# EAGLE design psp-panda (EAGLE 5.11)

## Sheet 1 of 6
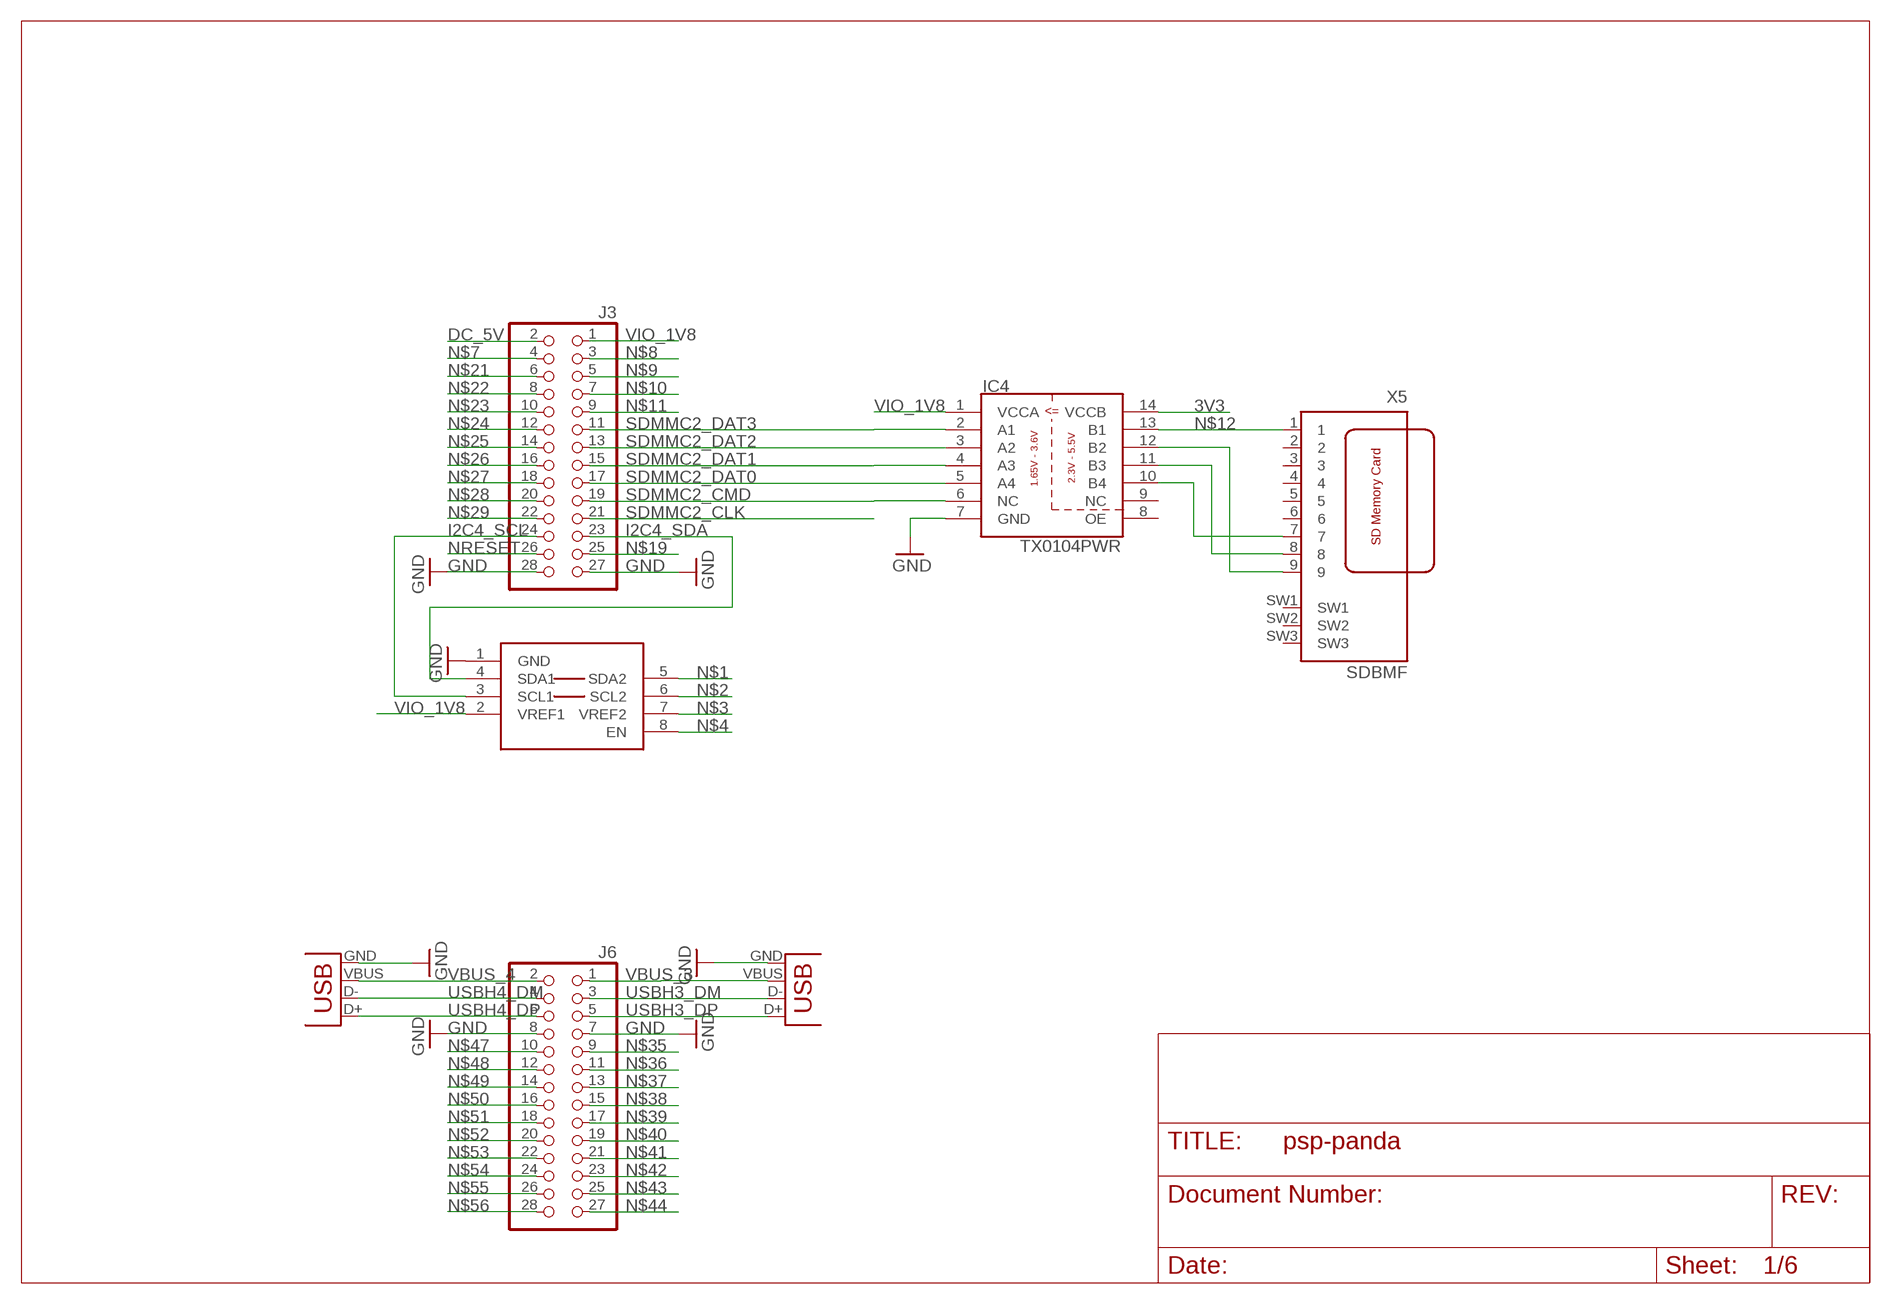
[diagram p0: schematic, sheet 1]

### Parts
IC4  TX0104PWR  [TSSOP14]
J3  PINHD-2X14  [2X14]
J6  PINHD-2X14  [2X14]
U$4  PCA9306  [PSOP-8]
X3  USB-A-S  [USB-A-S]
X4  USB-A-S  [USB-A-S]
X5  SDBMF  [SDBMF-009XXBXX2]

### Nets
3V3: IC4.14(VCCB) ; also sheet 2,4,5
DC_5V: J3.2
GND: IC4.7(GND) J3.27 J3.28 J6.7 J6.8 U$4.1(GND) X3.GND X4.GND ; also sheet 2,4,5,6
I2C4_SCL: J3.24 U$4.3(SCL1)
I2C4_SDA: J3.23 U$4.4(SDA1)
N$1: U$4.5(SDA2)
N$2: U$4.6(SCL2)
N$3: U$4.7(VREF2)
N$4: U$4.8(EN)
N$7: J3.4
N$8: J3.3
N$9: J3.5
N$10: J3.7
N$11: J3.9
N$12: IC4.13(B1) X5.1
N$13: IC4.12(B2) X5.9
N$14: IC4.11(B3) X5.8
N$15: IC4.10(B4) X5.7
N$19: J3.25
N$21: J3.6
N$22: J3.8
N$23: J3.10
N$24: J3.12
N$25: J3.14
N$26: J3.16
N$27: J3.18
N$28: J3.20
N$29: J3.22
N$35: J6.9
N$36: J6.11
N$37: J6.13
N$38: J6.15
N$39: J6.17
N$40: J6.19
N$41: J6.21
N$42: J6.23
N$43: J6.25
N$44: J6.27
N$47: J6.10
N$48: J6.12
N$49: J6.14
N$50: J6.16
N$51: J6.18
N$52: J6.20
N$53: J6.22
N$54: J6.24
N$55: J6.26
N$56: J6.28
NRESET: J3.26
SDMMC2_CLK: J3.21
SDMMC2_CMD: IC4.6(NC) J3.19
SDMMC2_DAT0: IC4.5(A4) J3.17
SDMMC2_DAT1: IC4.4(A3) J3.15
SDMMC2_DAT2: IC4.3(A2) J3.13
SDMMC2_DAT3: IC4.2(A1) J3.11
USBH3_DM: J6.3 X4.D-
USBH3_DP: J6.5 X4.D+
USBH4_DM: J6.4 X3.D-
USBH4_DP: J6.6 X3.D+
VBUS_3: J6.1 X4.VBUS
VBUS_4: J6.2 X3.VBUS
VIO_1V8: IC4.1(VCCA) J3.1 U$4.2(VREF1)
Unconnected: IC4.8(OE) IC4.9(NC) X5.2 X5.3 X5.4 X5.5 X5.6 X5.SW1 X5.SW2 X5.SW3

## Sheet 2 of 6
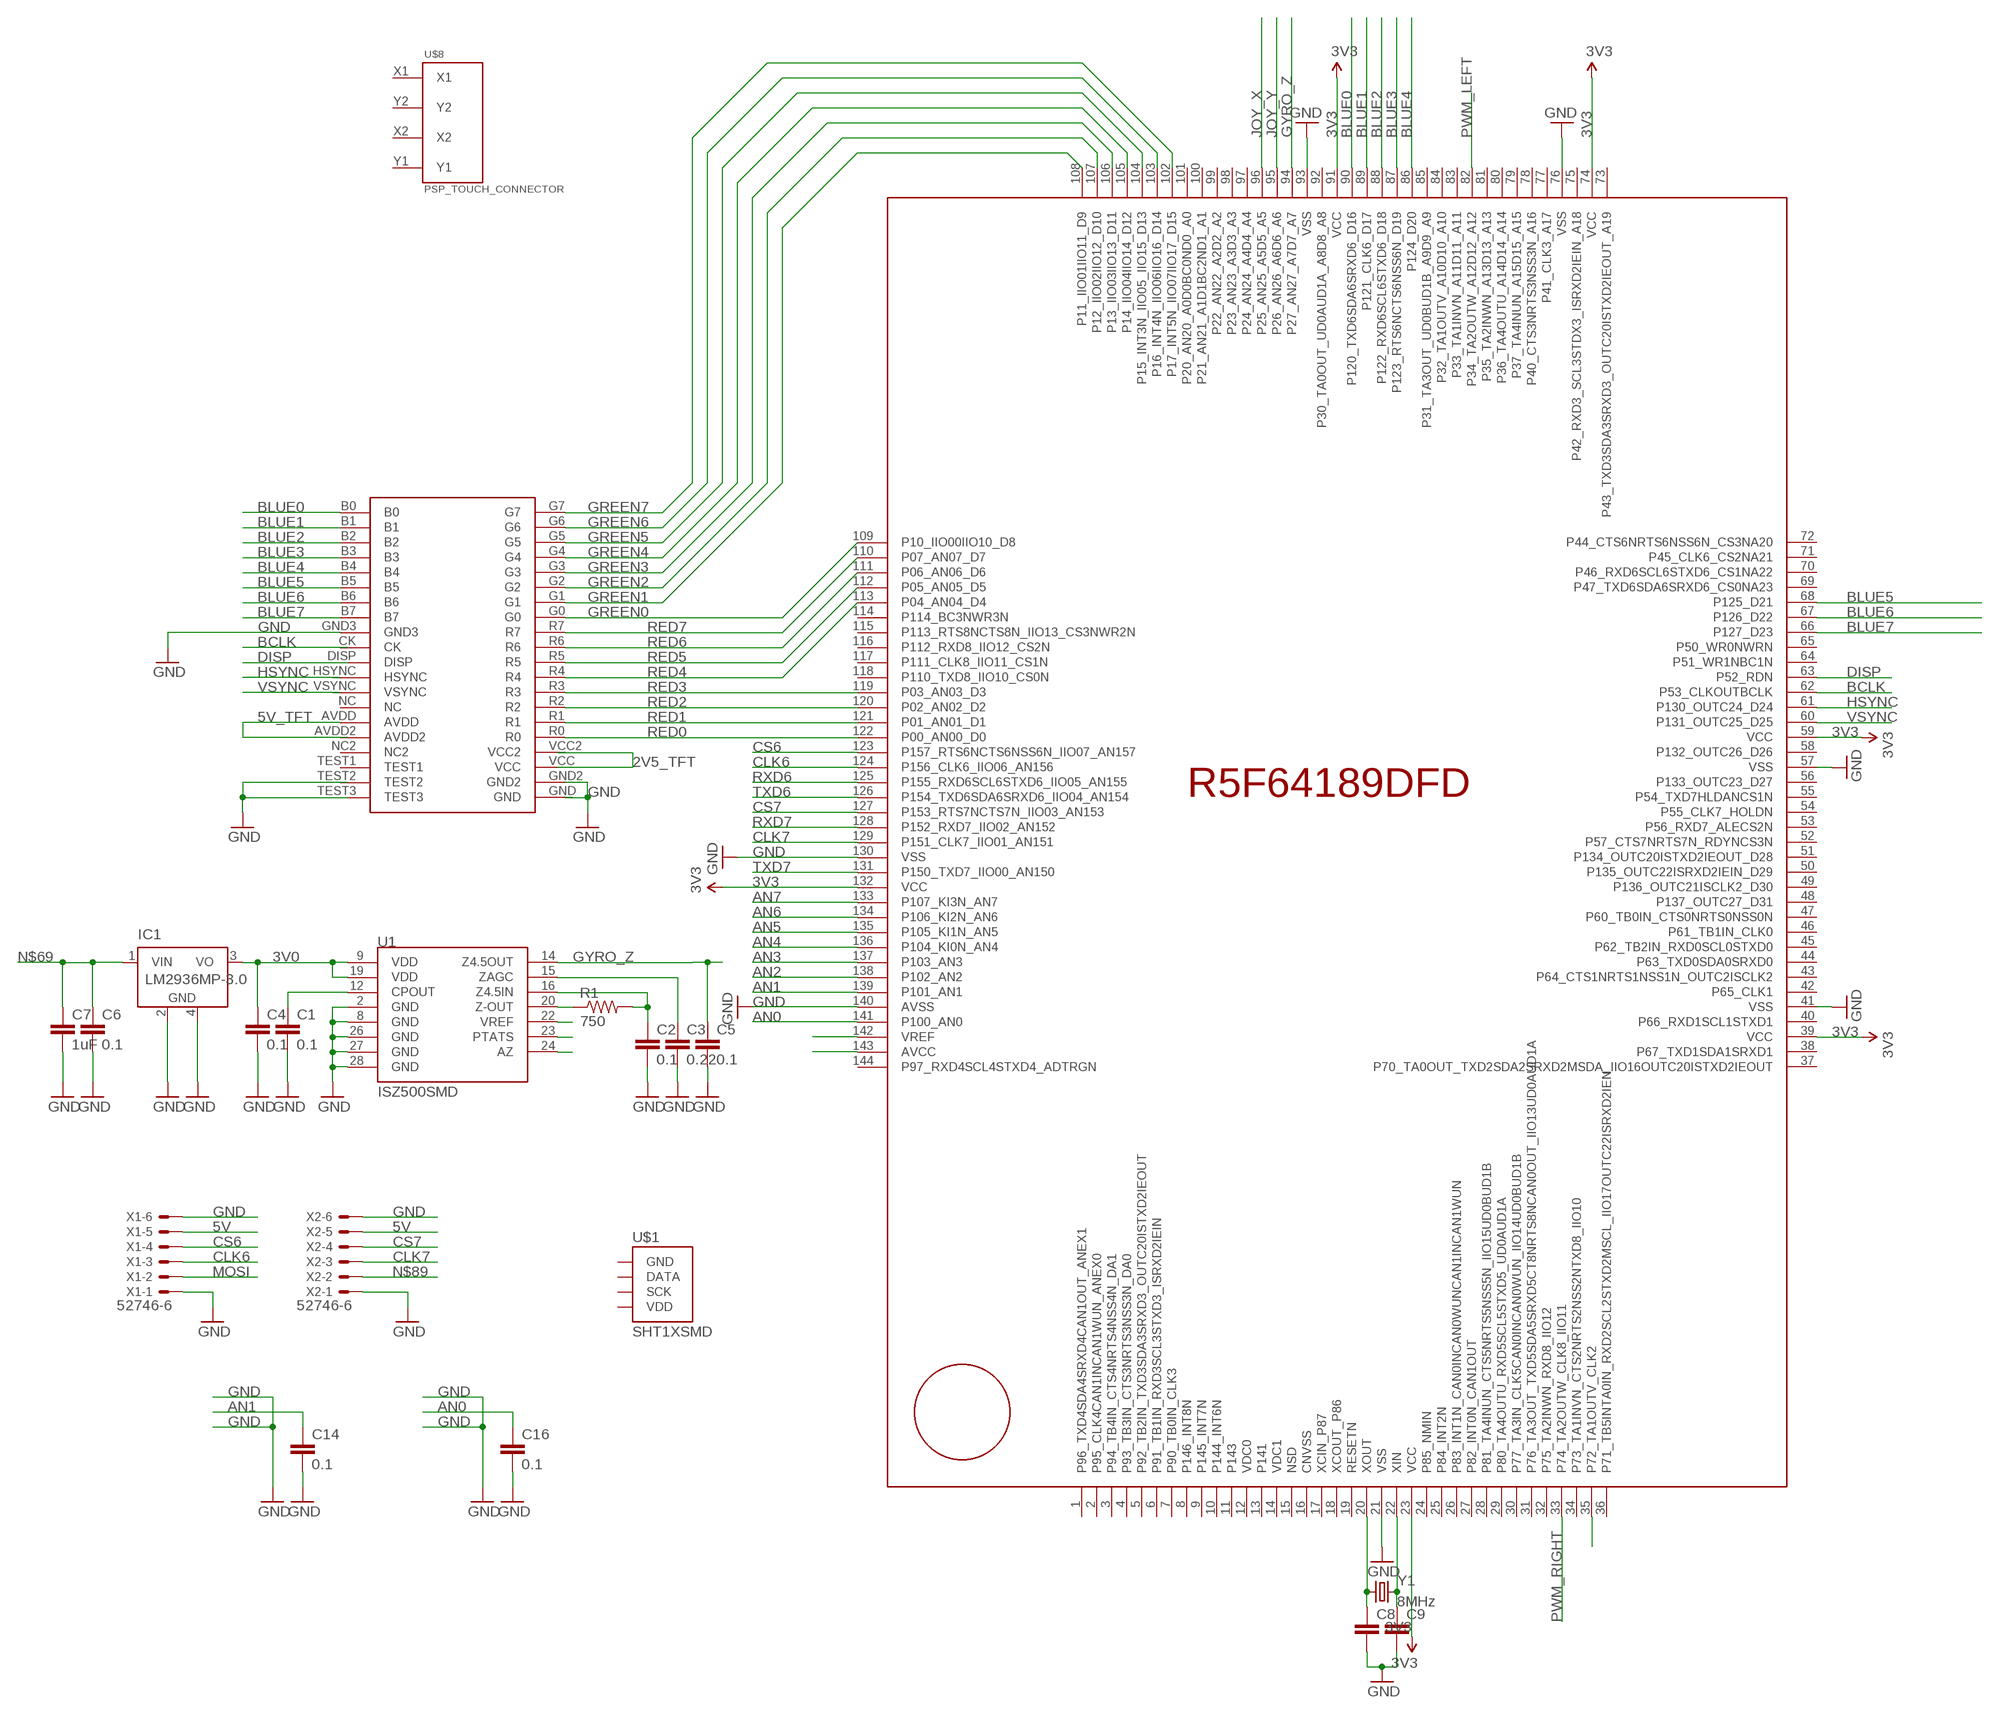
[diagram p1: schematic, sheet 2]

### Parts
C1  0.1  CAP0603-CAP  [0603-CAP]
C2  0.1  CAP0603-CAP  [0603-CAP]
C3  0.22  CAP0603-CAP  [0603-CAP]
C4  0.1  CAP0603-CAP  [0603-CAP]
C5  0.1  CAP0603-CAP  [0603-CAP]
C6  0.1  CAP0603-CAP  [0603-CAP]
C7  1uF  CAP0603-CAP  [0603-CAP]
C8  CAP0603-CAP  [0603-CAP]
C9  CAP0603-CAP  [0603-CAP]
C14  0.1  CAP0603-CAP  [0603-CAP]
C16  0.1  CAP0603-CAP  [0603-CAP]
IC1  LM2936MP-3.0  [SOT223]
R1  750  RESISTOR0603-RES  [0603-RES]
U1  ISZ500SMD  [QFN-28_6X8]
U$1  SHT1XSMD  [SHT1X]
U$7  R5F64189DFD  [TQFP144]
U$8  PSP_TOUCH_CONNECTOR  [PSP_TOUCH_CONNECTOR]
U$9  PSP_CONNECTOR  [PSP_CONNECTOR]
X1  52746-6  [52746-6]
X2  52746-6  [52746-6]
Y1  8MHz  CRYSTALHC49UV  [HC49U-V]

### Nets
2V5_TFT: U$9.VCC U$9.VCC2
3V0: C4.1 IC1.3(VO) U1.9(VDD) U1.19(VDD)
3V3: U$7.23(VCC) U$7.39(VCC) U$7.59(VCC) U$7.74(VCC) U$7.91(VCC) U$7.132(VCC) ; also sheet 1,4,5
5V: X1.5 X2.5
5V_TFT: U$9.AVDD U$9.AVDD2
AN0: C16.1 U$7.141(P100_AN0) ; also sheet 5
AN1: C14.1 U$7.139(P101_AN1) ; also sheet 4
AN2: U$7.138(P102_AN2)
AN3: U$7.137(P103_AN3)
AN4: U$7.136(P104_KI0N_AN4)
AN5: U$7.135(P105_KI1N_AN5)
AN6: U$7.134(P106_KI2N_AN6)
AN7: U$7.133(P107_KI3N_AN7)
BCLK: U$7.62(P53_CLKOUTBCLK) U$9.CK
BLUE0: U$7.90(P120_TXD6SDA6SRXD6_D16) U$9.B0
BLUE1: U$7.89(P121_CLK6_D17) U$9.B1
BLUE2: U$7.88(P122_RXD6SCL6STXD6_D18) U$9.B2
BLUE3: U$7.87(P123_RTS6NCTS6NSS6N_D19) U$9.B3
BLUE4: U$7.86(P124_D20) U$9.B4
BLUE5: U$7.68(P125_D21) U$9.B5
BLUE6: U$7.67(P126_D22) U$9.B6
BLUE7: U$7.66(P127_D23) U$9.B7
CLK6: U$7.124(P156_CLK6_IIO06_AN156) X1.3
CLK7: U$7.129(P151_CLK7_IIO01_AN151) X2.3
CPOUT: C1.1 U1.12(CPOUT)
CS6: U$7.123(P157_RTS6NCTS6NSS6N_IIO07_AN157) X1.4
CS7: U$7.127(P153_RTS7NCTS7N_IIO03_AN153) X2.4
DISP: U$7.63(P52_RDN) U$9.DISP
GND: C1.2 C2.2 C3.2 C4.2 C5.2 C6.2 C7.2 C8.2 C9.2 C14.2 C16.2 IC1.2(GND) IC1.4(GND) U1.2(GND) U1.8(GND) U1.26(GND) U1.27(GND) U1.28(GND) U$7.21(VSS) U$7.41(VSS) U$7.57(VSS) U$7.76(VSS) U$7.93(VSS) U$7.130(VSS) U$7.140(AVSS) U$9.GND U$9.GND2 U$9.GND3 X1.1 X1.6 X2.1 X2.6 ; also sheet 1,4,5,6
GREEN0: U$7.109(P10_IIO00IIO10_D8) U$9.G0
GREEN1: U$7.108(P11_IIO01IIO11_D9) U$9.G1
GREEN2: U$7.107(P12_IIO02IIO12_D10) U$9.G2
GREEN3: U$7.106(P13_IIO03IIO13_D11) U$9.G3
GREEN4: U$7.105(P14_IIO04IIO14_D12) U$9.G4
GREEN5: U$7.104(P15_INT3N_IIO05_IIO15_D13) U$9.G5
GREEN6: U$7.103(P16_INT4N_IIO06IIO16_D14) U$9.G6
GREEN7: U$7.102(P17_INT5N_IIO07IIO17_D15) U$9.G7
GYRO_Z: C5.1 U1.14(Z4.5OUT) U$7.94(P27_AN27_A7D7_A7)
HSYNC: U$7.61(P130_OUTC24_D24) U$9.HSYNC
JOY_X: U$7.96(P25_AN25_A5D5_A5)
JOY_Y: U$7.95(P26_AN26_A6D6_A6)
MOSI: X1.2
N$5: C8.1 U$7.20(XOUT) Y1.1
N$45: C9.1 U$7.22(XIN) Y1.2
N$61: U$7.143(AVCC)
N$62: U$7.142(VREF)
N$63: C2.1 R1.2 U1.16(Z4.5IN)
N$64: R1.1 U1.20(Z-OUT)
N$65: C3.1 U1.15(ZAGC)
N$66: U1.23(PTATS)
N$67: U1.22(VREF)
N$68: U1.24(AZ)
N$69: C6.1 C7.1 IC1.1(VIN)
N$70: U$7.35(P72_TA1OUTV_CLK2)
N$89: X2.2
PWM_LEFT: U$7.82(P34_TA2OUTW_A12D12_A12)
PWM_RIGHT: U$7.33(P74_TA2OUTW_CLK8_IIO11)
RED0: U$7.122(P00_AN00_D0) U$9.R0
RED1: U$7.121(P01_AN01_D1) U$9.R1
RED2: U$7.120(P02_AN02_D2) U$9.R2
RED3: U$7.119(P03_AN03_D3) U$9.R3
RED4: U$7.113(P04_AN04_D4) U$9.R4
RED5: U$7.112(P05_AN05_D5) U$9.R5
RED6: U$7.111(P06_AN06_D6) U$9.R6
RED7: U$7.110(P07_AN07_D7) U$9.R7
RXD6: U$7.125(P155_RXD6SCL6STXD6_IIO05_AN155)
RXD7: U$7.128(P152_RXD7_IIO02_AN152)
TXD6: U$7.126(P154_TXD6SDA6SRXD6_IIO04_AN154)
TXD7: U$7.131(P150_TXD7_IIO00_AN150)
VSYNC: U$7.60(P131_OUTC25_D25) U$9.VSYNC
Unconnected: U$1.2(DATA) U$1.3(SCK) U$7.1(P96_TXD4SDA4SRXD4CAN1OUT_ANEX1) U$7.2(P95_CLK4CAN1INCAN1WUN_ANEX0) U$7.3(P94_TB4IN_CTS4NRTS4NSS4N_DA1) U$7.4(P93_TB3IN_CTS3NRTS3NSS3N_DA0) U$7.5(P92_TB2IN_TXD3SDA3SRXD3_OUTC20ISTXD2IEOUT) U$7.6(P91_TB1IN_RXD3SCL3STXD3_ISRXD2IEIN) U$7.7(P90_TB0IN_CLK3) U$7.8(P146_INT8N) U$7.9(P145_INT7N) U$7.10(P144_INT6N) U$7.11(P143) U$7.12(VDC0) U$7.13(P141) U$7.14(VDC1) U$7.15(NSD) U$7.16(CNVSS) U$7.17(XCIN_P87) U$7.18(XCOUT_P86) U$7.19(RESETN) U$7.24(P85_NMIN) U$7.25(P84_INT2N) U$7.26(P83_INT1N_CAN0INCAN0WUNCAN1INCAN1WUN) U$7.27(P82_INT0N_CAN1OUT) U$7.28(P81_TA4INUN_CTS5NRTS5NSS5N_IIO15UD0BUD1B) U$7.29(P80_TA4OUTU_RXD5SCL5STXD5_UD0AUD1A) U$7.30(P77_TA3IN_CLK5CAN0INCAN0WUN_IIO14UD0BUD1B) U$7.31(P76_TA3OUT_TXD5SDA5SRXD5CT8NRTS8NCAN0OUT_IIO13UD0AUD1A) U$7.32(P75_TA2INWN_RXD8_IIO12) U$7.34(P73_TA1INVN_CTS2NRTS2NSS2NTXD8_IIO10) U$7.36(P71_TB5INTA0IN_RXD2SCL2STXD2MSCL_IIO17OUTC22ISRXD2IEN) U$7.37(P70_TA0OUT_TXD2SDA2SRXD2MSDA_IIO16OUTC20ISTXD2IEOUT) U$7.38(P67_TXD1SDA1SRXD1) U$7.40(P66_RXD1SCL1STXD1) U$7.42(P65_CLK1) U$7.43(P64_CTS1NRTS1NSS1N_OUTC2ISCLK2) U$7.44(P63_TXD0SDA0SRXD0) U$7.45(P62_TB2IN_RXD0SCL0STXD0) U$7.46(P61_TB1IN_CLK0) U$7.47(P60_TB0IN_CTS0NRTS0NSS0N) U$7.48(P137_OUTC27_D31) U$7.49(P136_OUTC21ISCLK2_D30) U$7.50(P135_OUTC22ISRXD2IEIN_D29) U$7.51(P134_OUTC20ISTXD2IEOUT_D28) U$7.52(P57_CTS7NRTS7N_RDYNCS3N) U$7.53(P56_RXD7_ALECS2N) U$7.54(P55_CLK7_HOLDN) U$7.55(P54_TXD7HLDANCS1N) U$7.56(P133_OUTC23_D27) U$7.58(P132_OUTC26_D26) U$7.64(P51_WR1NBC1N) U$7.65(P50_WR0NWRN) U$7.69(P47_TXD6SDA6SRXD6_CS0NA23) U$7.70(P46_RXD6SCL6STXD6_CS1NA22) U$7.71(P45_CLK6_CS2NA21) U$7.72(P44_CTS6NRTS6NSS6N_CS3NA20) U$7.73(P43_TXD3SDA3SRXD3_OUTC20ISTXD2IEOUT_A19) U$7.75(P42_RXD3_SCL3STDX3_ISRXD2IEIN_A18) U$7.77(P41_CLK3_A17) U$7.78(P40_CTS3NRTS3NSS3N_A16) U$7.79(P37_TA4INUN_A15D15_A15) U$7.80(P36_TA4OUTU_A14D14_A14) U$7.81(P35_TA2INWN_A13D13_A13) U$7.83(P33_TA1INVN_A11D11_A11) U$7.84(P32_TA1OUTV_A10D10_A10) U$7.85(P31_TA3OUT_UD0BUD1B_A9D9_A9) U$7.92(P30_TA0OUT_UD0AUD1A_A8D8_A8) U$7.97(P24_AN24_A4D4_A4) U$7.98(P23_AN23_A3D3_A3) U$7.99(P22_AN22_A2D2_A2) U$7.100(P21_AN21_A1D1BC2ND1_A1) U$7.101(P20_AN20_A0D0BC0ND0_A0) U$7.114(P114_BC3NWR3N) U$7.115(P113_RTS8NCTS8N_IIO13_CS3NWR2N) U$7.116(P112_RXD8_IIO12_CS2N) U$7.117(P111_CLK8_IIO11_CS1N) U$7.118(P110_TXD8_IIO10_CS0N) U$7.144(P97_RXD4SCL4STXD4_ADTRGN) U$8.X1 U$8.X2 U$8.Y1 U$8.Y2 U$9.NC U$9.NC2 U$9.TEST1 U$9.TEST2 U$9.TEST3

## Sheet 3 of 6
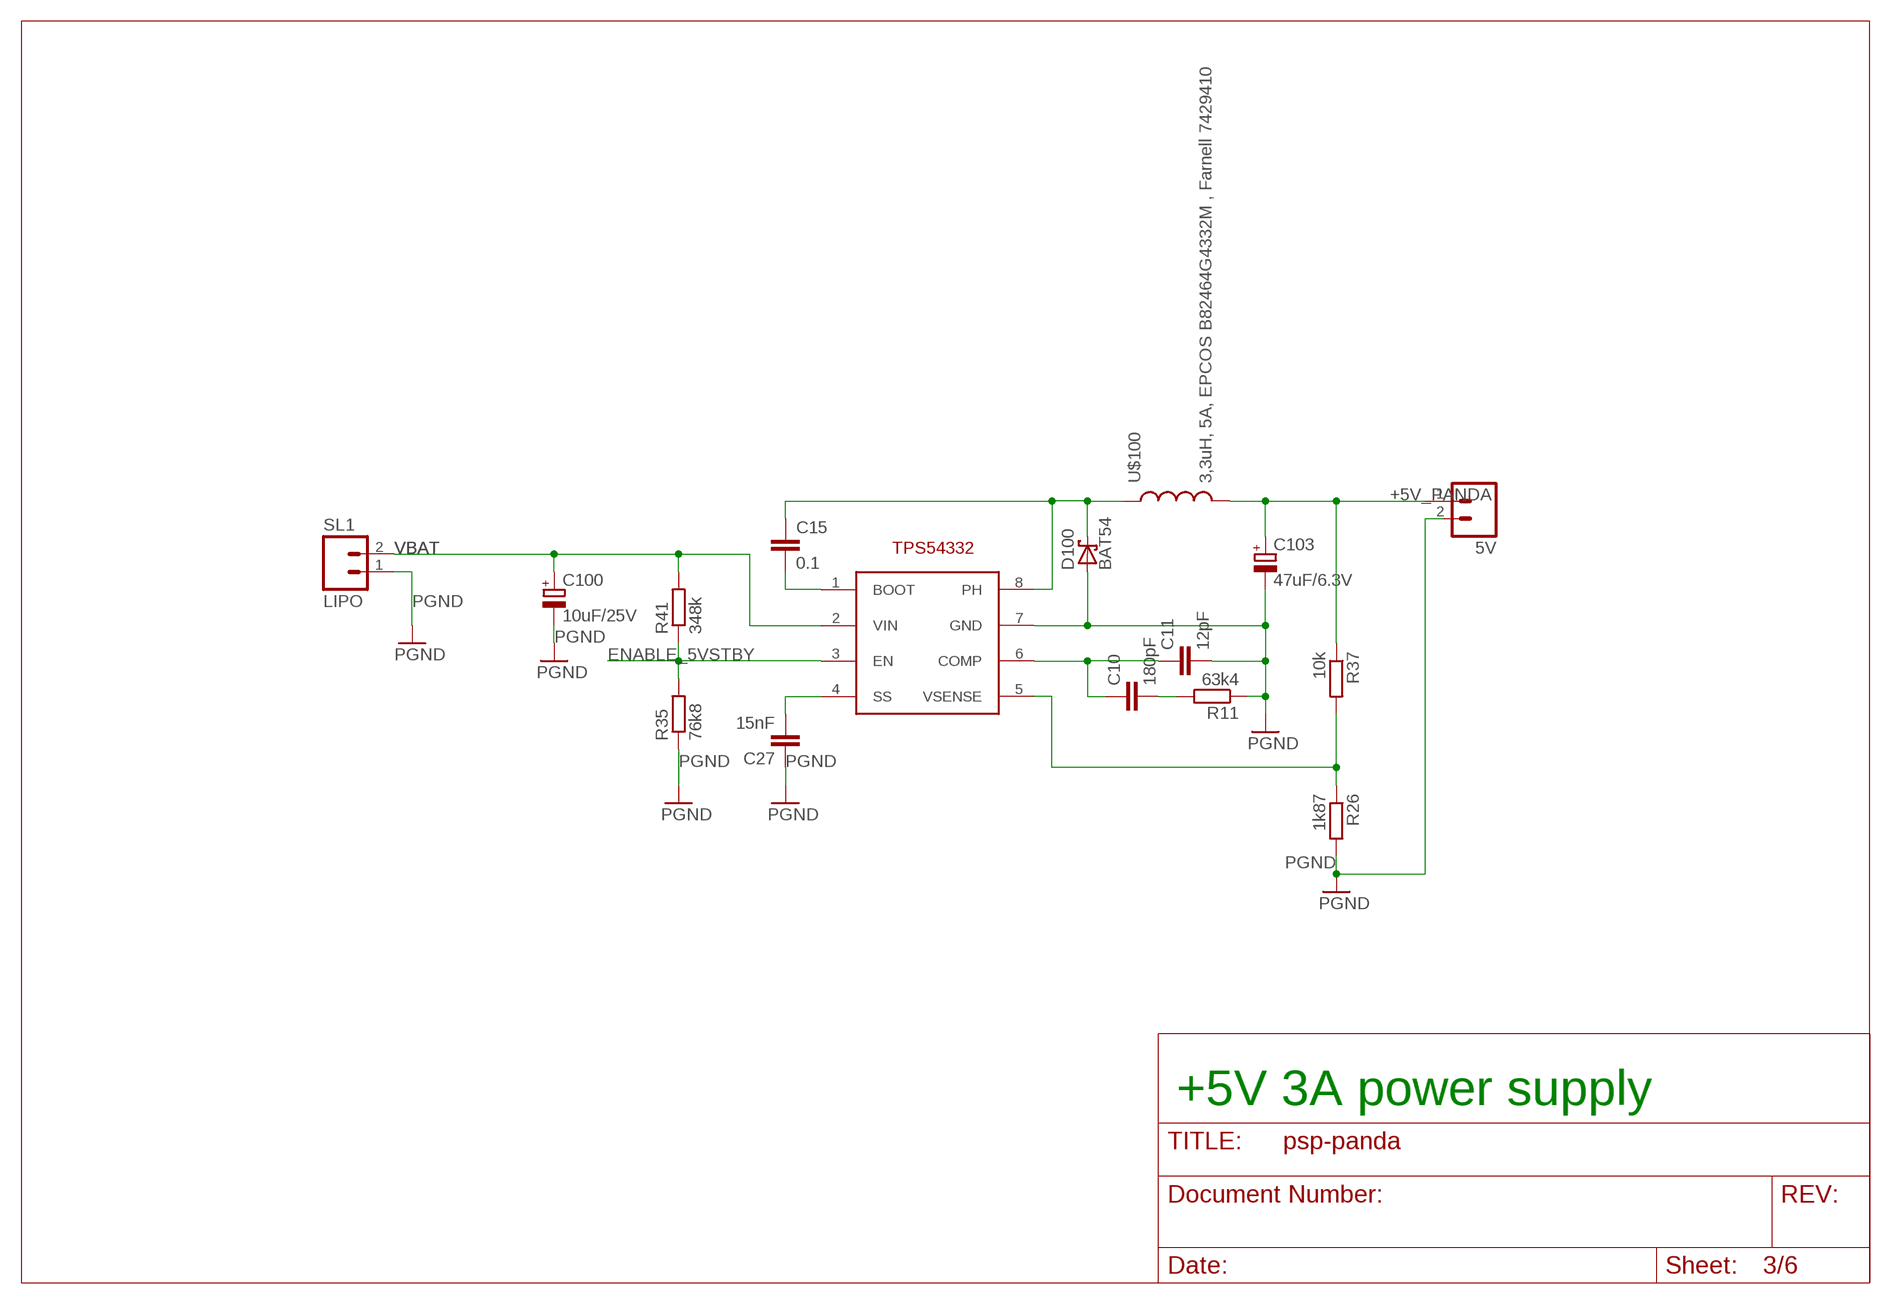
[diagram p2: schematic, sheet 3]

### Parts
5V  M02  [02P]
C10  180pF  C-EUC0805K  [C0805K]
C11  12pF  C-EUC0805K  [C0805K]
C15  0.1  C-EUC0805K  [C0805K]
C27  15nF  C-EUC0805K  [C0805K]
C100  10uF/25V  CPOL-EU153CLV-0807  [153CLV-0807]
C103  47uF/6.3V  CPOL-EU153CLV-0807  [153CLV-0807]
D100  BAT54  [SOT23]
R11  63k4  R-EU_R0805  [R0805]
R26  1k87  R-EU_R0805  [R0805]
R35  76k8  R-EU_R0805  [R0805]
R37  10k  R-EU_R0805  [R0805]
R41  348k  R-EU_R0805  [R0805]
SL1  LIPO  M02  [02P]
U$3  TPS54332  [SO8]
U$100  3,3uH, 5A, EPCOS B82464G4332M , Farnell 7429410  INDUCTORCR75  [CR75]

### Nets
+5V_PANDA [somepower]: 5V.1 C103.+ R37.1 U$100.P$2
ENABLE_5VSTBY: R35.2 R41.1 U$3.3(EN)
N$6: C10.1 C11.1 U$3.6(COMP)
N$18: C10.2 R11.2
N$20: C27.2 U$3.4(SS)
N$30: C15.2 U$3.1(BOOT)
N$32: R26.1 R37.2 U$3.5(VSENSE)
N$33 [somepower]: C15.1 D100.3(C) U$3.8(PH) U$100.P$1
PGND [power]: 5V.2 C11.2 C27.1 C100.- C103.- D100.1(A) R11.1 R26.2 R35.1 SL1.1 U$3.7(GND)
VBAT [power]: C100.+ R41.2 SL1.2 U$3.2(VIN)

### Notes on the sheet
- +5V 3A power supply

## Sheet 4 of 6
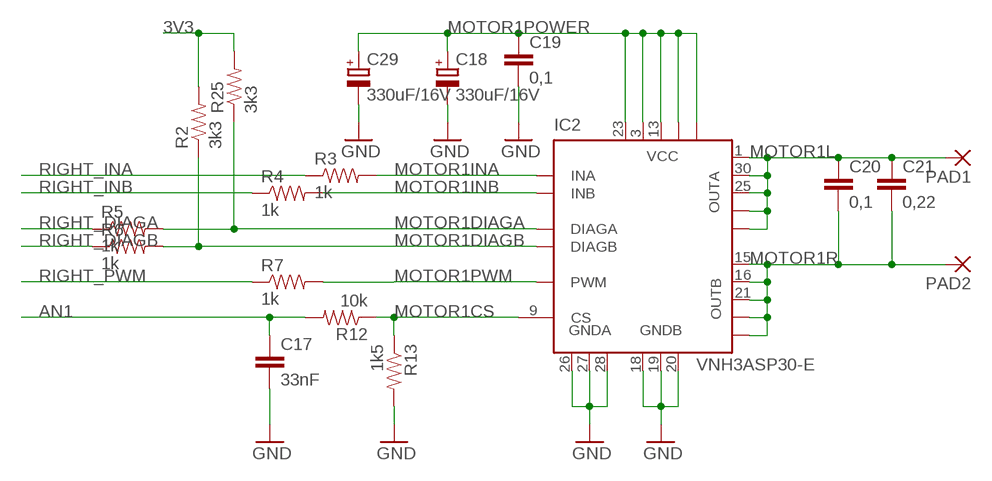
[diagram p3: schematic, sheet 4]

### Parts
C17  33nF  CAP0603-CAP  [0603-CAP]
C18  330uF/16V  CPOL-EU153CLV-1014  [153CLV-1014]
C19  0,1  CAP0603-CAP  [0603-CAP]
C20  0,1  CAP0603-CAP  [0603-CAP]
C21  0,22  CAP0603-CAP  [0603-CAP]
C29  330uF/16V  CPOL-EU153CLV-1014  [153CLV-1014]
IC2  VNH3ASP30-E  [MULTIPOWERSO-30]
PAD1  3,81/1,4  [3,81/1,4]
PAD2  3,81/1,4  [3,81/1,4]
R2  3k3  RESISTOR0603-RES  [0603-RES]
R3  1k  RESISTOR0603-RES  [0603-RES]
R4  1k  RESISTOR0603-RES  [0603-RES]
R5  1k  RESISTOR0603-RES  [0603-RES]
R6  1k  RESISTOR0603-RES  [0603-RES]
R7  1k  RESISTOR0603-RES  [0603-RES]
R12  10k  RESISTOR0603-RES  [0603-RES]
R13  1k5  RESISTOR0603-RES  [0603-RES]
R25  3k3  RESISTOR0603-RES  [0603-RES]

### Nets
3V3: R2.2 R25.2 ; also sheet 1,2,5
AN1: C17.1 R12.2 ; also sheet 2
GND: C17.2 C18.- C19.2 C29.- IC2.18(GNDB) IC2.19(GNDB) IC2.20(GNDB) IC2.26(GNDA) IC2.27(GNDA) IC2.28(GNDA) R13.2 ; also sheet 1,2,5,6
MOTOR1CS: IC2.9(CS) R12.1 R13.1
MOTOR1DIAGA: IC2.6(DIAGA) R5.2 R25.1
MOTOR1DIAGB: IC2.10(DIAGB) R2.1 R6.2
MOTOR1INA: IC2.5(INA) R3.2
MOTOR1INB: IC2.11(INB) R4.2
MOTOR1L [power]: C20.1 C21.1 IC2.1(OUTA) IC2.25(OUTA) IC2.30(OUTA) IC2.OUTA IC2.OUTA@1(OUTA) PAD1.1(P)
MOTOR1POWER [power]: C18.+ C19.1 C29.+ IC2.3(VCC) IC2.13(VCC) IC2.23(VCC) IC2.VCC IC2.VCC@1(VCC)
MOTOR1PWM: IC2.8(PWM) R7.2
MOTOR1R [power]: C20.2 C21.2 IC2.15(OUTB) IC2.16(OUTB) IC2.21(OUTB) IC2.OUTB IC2.OUTB@1(OUTB) PAD2.1(P)
RIGHT_DIAGA: R5.1
RIGHT_DIAGB: R6.1
RIGHT_INA: R3.1
RIGHT_INB: R4.1
RIGHT_PWM: R7.1

## Sheet 5 of 6
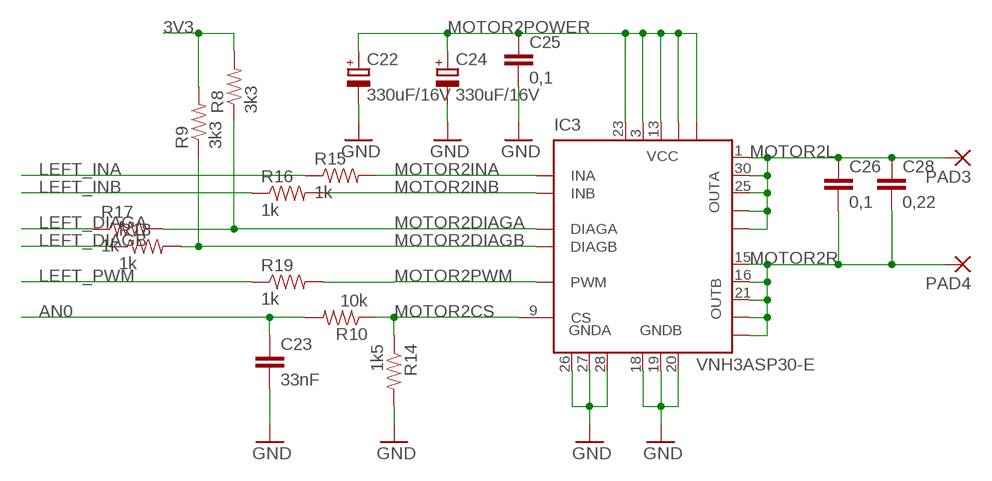
[diagram p4: schematic, sheet 5]

### Parts
C22  330uF/16V  CPOL-EU153CLV-1014  [153CLV-1014]
C23  33nF  CAP0603-CAP  [0603-CAP]
C24  330uF/16V  CPOL-EU153CLV-1014  [153CLV-1014]
C25  0,1  CAP0603-CAP  [0603-CAP]
C26  0,1  CAP0603-CAP  [0603-CAP]
C28  0,22  CAP0603-CAP  [0603-CAP]
IC3  VNH3ASP30-E  [MULTIPOWERSO-30]
PAD3  3,81/1,4  [3,81/1,4]
PAD4  3,81/1,4  [3,81/1,4]
R8  3k3  RESISTOR0603-RES  [0603-RES]
R9  3k3  RESISTOR0603-RES  [0603-RES]
R10  10k  RESISTOR0603-RES  [0603-RES]
R14  1k5  RESISTOR0603-RES  [0603-RES]
R15  1k  RESISTOR0603-RES  [0603-RES]
R16  1k  RESISTOR0603-RES  [0603-RES]
R17  1k  RESISTOR0603-RES  [0603-RES]
R18  1k  RESISTOR0603-RES  [0603-RES]
R19  1k  RESISTOR0603-RES  [0603-RES]

### Nets
3V3: R8.2 R9.2 ; also sheet 1,2,4
AN0: C23.1 R10.2 ; also sheet 2
GND: C22.- C23.2 C24.- C25.2 IC3.18(GNDB) IC3.19(GNDB) IC3.20(GNDB) IC3.26(GNDA) IC3.27(GNDA) IC3.28(GNDA) R14.2 ; also sheet 1,2,4,6
LEFT_DIAGA: R17.1
LEFT_DIAGB: R18.1
LEFT_INA: R15.1
LEFT_INB: R16.1
LEFT_PWM: R19.1
MOTOR2CS: IC3.9(CS) R10.1 R14.1
MOTOR2DIAGA: IC3.6(DIAGA) R8.1 R17.2
MOTOR2DIAGB: IC3.10(DIAGB) R9.1 R18.2
MOTOR2INA: IC3.5(INA) R15.2
MOTOR2INB: IC3.11(INB) R16.2
MOTOR2L [power]: C26.1 C28.1 IC3.1(OUTA) IC3.25(OUTA) IC3.30(OUTA) IC3.OUTA IC3.OUTA@1(OUTA) PAD3.1(P)
MOTOR2POWER [power]: C22.+ C24.+ C25.1 IC3.3(VCC) IC3.13(VCC) IC3.23(VCC) IC3.VCC IC3.VCC@1(VCC)
MOTOR2PWM: IC3.8(PWM) R19.2
MOTOR2R [power]: C26.2 C28.2 IC3.15(OUTB) IC3.16(OUTB) IC3.21(OUTB) IC3.OUTB IC3.OUTB@1(OUTB) PAD4.1(P)

## Sheet 6 of 6
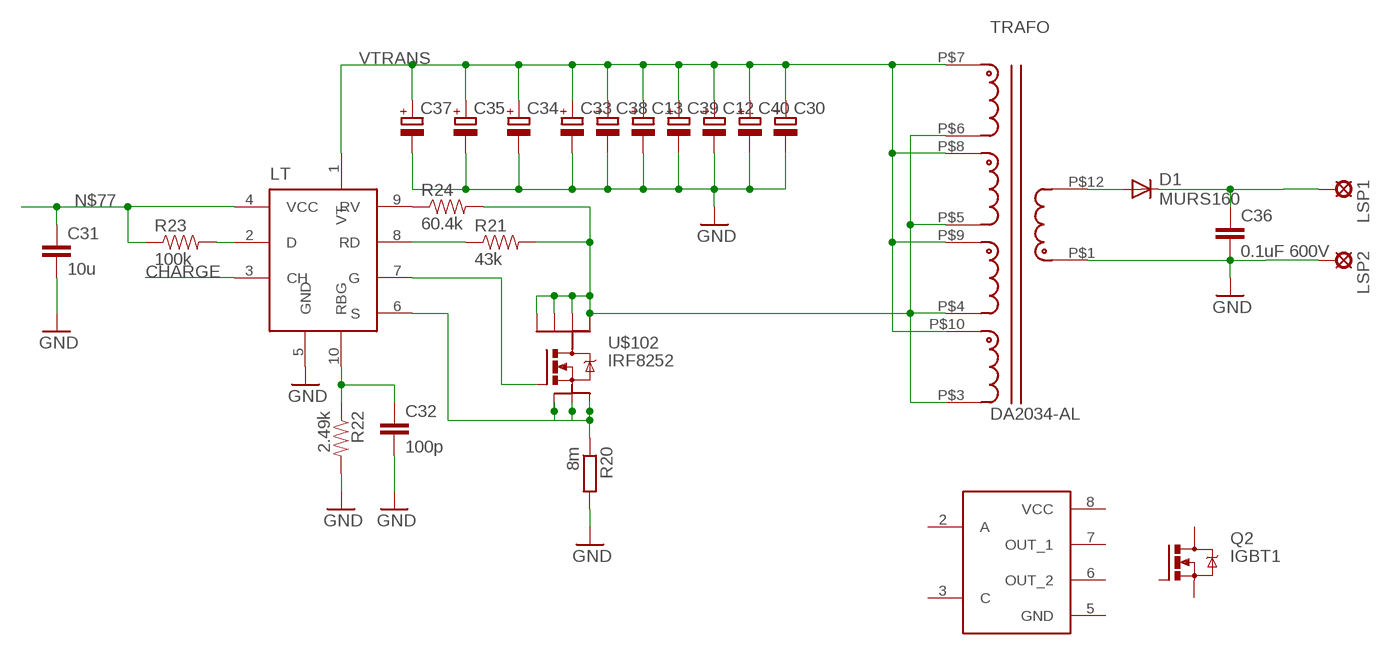
[diagram p5: schematic, sheet 6]

### Parts
C12  CPOL-EUCT6032  [CT6032]
C13  CPOL-EUCT6032  [CT6032]
C30  CPOL-EUCT6032  [CT6032]
C31  10u  C-EUC1210  [C1210]
C32  100p  CAP0603-CAP  [0603-CAP]
C33  CPOL-EUCT6032  [CT6032]
C34  CPOL-EUCT6032  [CT6032]
C35  CPOL-EUCT6032  [CT6032]
C36  0.1uF 600V  C-EUC1812  [C1812]
C37  CPOL-EUCT6032  [CT6032]
C38  CPOL-EUCT6032  [CT6032]
C39  CPOL-EUCT6032  [CT6032]
C40  CPOL-EUCT6032  [CT6032]
D1  MURS160  ES2D  [SMB]
LSP1  LSP11  [LSP11]
LSP2  LSP11  [LSP11]
LT  LT3750  [MSOP]
Q2  IGBT1  IRFPC40  [TO247BV]
R20  8m  R-EU_R1210  [R1210]
R21  43k  RESISTOR0603-RES  [0603-RES]
R22  2.49k  RESISTOR0603-RES  [0603-RES]
R23  100k  RESISTOR0603-RES  [0603-RES]
R24  60.4k  RESISTOR0603-RES  [0603-RES]
TRAFO  DA2034-AL  [DA2034-AL]
U$10  HCPL3180  [DIL8-SMD]
U$102  IRF8252  [SO8]

### Nets
CHARGE: LT.3(CH)
GND: C12.- C13.- C30.- C31.2 C32.2 C33.- C34.- C35.- C36.2 C37.- C38.- C39.- C40.- LSP2.MP LT.5(GND) R20.2 R22.2 TRAFO.P$1 ; also sheet 1,2,4,5
N$71: D1.A TRAFO.P$12
N$72: LT.7(G) U$102.4(G)
N$73: LT.9(RV) R24.1
N$74: LT.8(RD) R21.1
N$75: R21.2 R24.2 TRAFO.P$3 TRAFO.P$4 TRAFO.P$5 TRAFO.P$6 U$102.5(D) U$102.6(D) U$102.7(D) U$102.8(D)
N$76: LT.6(S) R20.1 U$102.1(S) U$102.2(S) U$102.3(S)
N$77: C31.1 LT.4(VCC) R23.1
N$78: C32.1 LT.10(RBG) R22.1
N$79: LT.2(D) R23.2
N$80: C36.1 D1.C LSP1.MP
VTRANS: C12.+ C13.+ C30.+ C33.+ C34.+ C35.+ C37.+ C38.+ C39.+ C40.+ LT.1(VT) TRAFO.P$7 TRAFO.P$8 TRAFO.P$9 TRAFO.P$10
Unconnected: Q2.D Q2.G Q2.S U$10.2(A) U$10.3(C) U$10.5(GND) U$10.6(OUT_2) U$10.7(OUT_1) U$10.8(VCC)

## Power pins joined to a net without a drawn wire
GND: U$1.1(GND)
VDD: U$1.4(VDD)

## Library data of the parts
5V SL1 = con-amp-quick:M02: AMP QUICK CONNECTOR; OC_FARNELL: unknown; OC_NEWARK: unknown
C1-C9 C14 C16 C17 C19-C21 C23 C25 C26 C28 C32 = SparkFun:CAP: Capacitor Standard 0603 ceramic capacitor, and 0.1" leaded capacitor.
C10 C11 C15 C27 C31 C36 = rcl:C-EU: CAPACITOR, European symbol
C12 C13 C18 C22 C24 C29 C30 C33-C35 C37-C40 = rcl:CPOL-EU: POLARIZED CAPACITOR, European symbol
C100 C103 = resistor:CPOL-EU: POLARIZED CAPACITOR, European symbol
D1 = diode:ES2D: DIODE super fast rectifier, 2 A
D100 = diode:BAT54: Schottky Diodes Source: Fairchild .. BAT54.pdf
IC1 = national-semiconductor:LM2936MP?*: Ultra-Low Quiescent Current LDO Voltage Regulator Source: Data sheet <http://www.national.com/ds/LM/LM2936.pdf>; MF: NATIONAL SEMICONDUCTOR; MPN: LM2936MP-3.0/NOPB; OC_FARNELL: 1496125; OC_NEWARK: 41K4522
IC2 IC3 = st-microelectronics:VNH3ASP30-E: FULLY INTEGRATED H-BRIDGE MOTOR DRIVER Source: http://pdf1.alldatasheet.com/datasheet-pdf/view/84563/STMICROELECTRONICS/VNH3SP30.html
IC4 = dan-translate:TX0104: TXB0104 or TXS0104 TXB0104 4-BIT BIDIRECTIONAL VOLTAGE-LEVEL TRANSLATOR WITH AUTOMATIC DIRECTION SENSING AND ±15-kV ESD PROTECTION FEATURES 1.2 V to 3.6 V on A Port and 1.65 V to 5.5 V on B Port (VCCA <= VCCB) VCC Isolation Feature - If Either VCC Input Is at GND, All Outputs Are in the High-Impedance State OE Input Circuit Referenced to VCCA Low Power Consumption, 5-uA Max ICC Ioff Supports Partial-Power-Down Mode Operation TXS0104 4-BIT BIDIRECTIONAL VOLTAGE-LEVEL TRANSLATOR FOR OPEN-DRAIN AND PUSH-PULL APPLICATIONS
J3 J6 = pinhead:PINHD-2X14: PIN HEADER
LSP1 LSP2 = solpad:LSP11: SOLDER PAD drill 1.1 mm
LT = mylbr:LT3750
PAD1-PAD4 = wirepad:3,81/1,4: THROUGH-HOLE PAD
Q2 = transistor-power:IRFPC40: N-CHANNEL MOS FET
R1-R10 R12-R19 R21-R25 = SparkFun:RESISTOR: Resistor Basic schematic elements and footprints for 0603, 1206, and PTH resistors.
R11 R26 R35 R37 R41 = resistor:R-EU_: RESISTOR, European symbol
R20 = rcl:R-EU_: RESISTOR, European symbol
TRAFO = inductor-coilcraft-2:DA2034-AL: Flyback Transformer for Linear Technology LT3750 Reference: http://www.coilcraft.com/da2032.cfm L - 10 uH TurnsRatio Pri:Sec - 1:10 Ipeak - 10.0 A Interwinding capacitance - 128 pF DCRmax: Pri - 0.018, Sec - 1.75 Ohms
U1 = SparkFun:ISZ500: ISZ500 Single axis gyro
U$1 = SparkFun:SHT1X: SHT1x Humdity Sensor Sensirion humdity sensor. Schematic element and footprint proven. Spark Fun Electronics SKU : COM-08227
U$3 = tonu:TPS54332
U$4 = SparkFun:PCA9306
U$7 = samuel:R5F64189DFD
U$8 = SparkFun:PSP_TOUCH_CONNECTOR: 4-Pin Connector for PSP Touch Screen
U$9 = SparkFun:PSP_CONNECTOR
U$10 = optocoupler:HCPL3180: Gate drive optocoupler
U$100 = SparkFun:INDUCTOR: Inductors Basic Inductor/Choke - 0603 and 1206. Footprints are not proven and vary greatly between part numbers.
U$102 = tonu:IRF8252
X1 X2 = con-molex:52746-6: FPC Connector ZIF for SMT 0.5mm Source: http://www.farnell.com/datasheets/73044.pdf [DWG. NO. (Sheet 1 OF 2) SD-52746-**17]; OC_FARNELL: unknown; OC_NEWARK: unknown
X3 X4 = SparkFun:USB: USB Connectors USB-B-PTH is fully proven SKU : PRT-00139 USB-miniB is fully proven SKU : PRT-00587 USB-A-PCB is untested. USB-A-H is throughly reviewed, but untested. Spark Fun Electronics SKU : PRT-00437 USB-B-SMT is throughly reviewed, but untested. Needs silkscreen touching up. USB-A-S has not been used/tested USB-MB-H has not been used/tested
X5 = farnell:SDBMF: SD MEMORY CARD PUSH-PUSH WITH CONNECTOR TYPE B (BIG SWUÌTCH #3) KINGFONT PRECISION INDUSTIAL CO., LTD Source: http://www.farnell.com/datasheets/74273.pdf Best.-Nr.: 9186174 Hersteller: MULTICOMP Herstellerbez.: SDBMF-00915B0T2
Y1 = SparkFun:CRYSTAL: Crystals Various standard crystals. Proven footprints. Spark Fun Electronics SKU : COM-00534

## Net classes
1 power: width 0.635 mm, clearance 0.203 mm
2 somepower: width 0.508 mm, drill 0.305 mm, clearance 0.254 mm

## Board
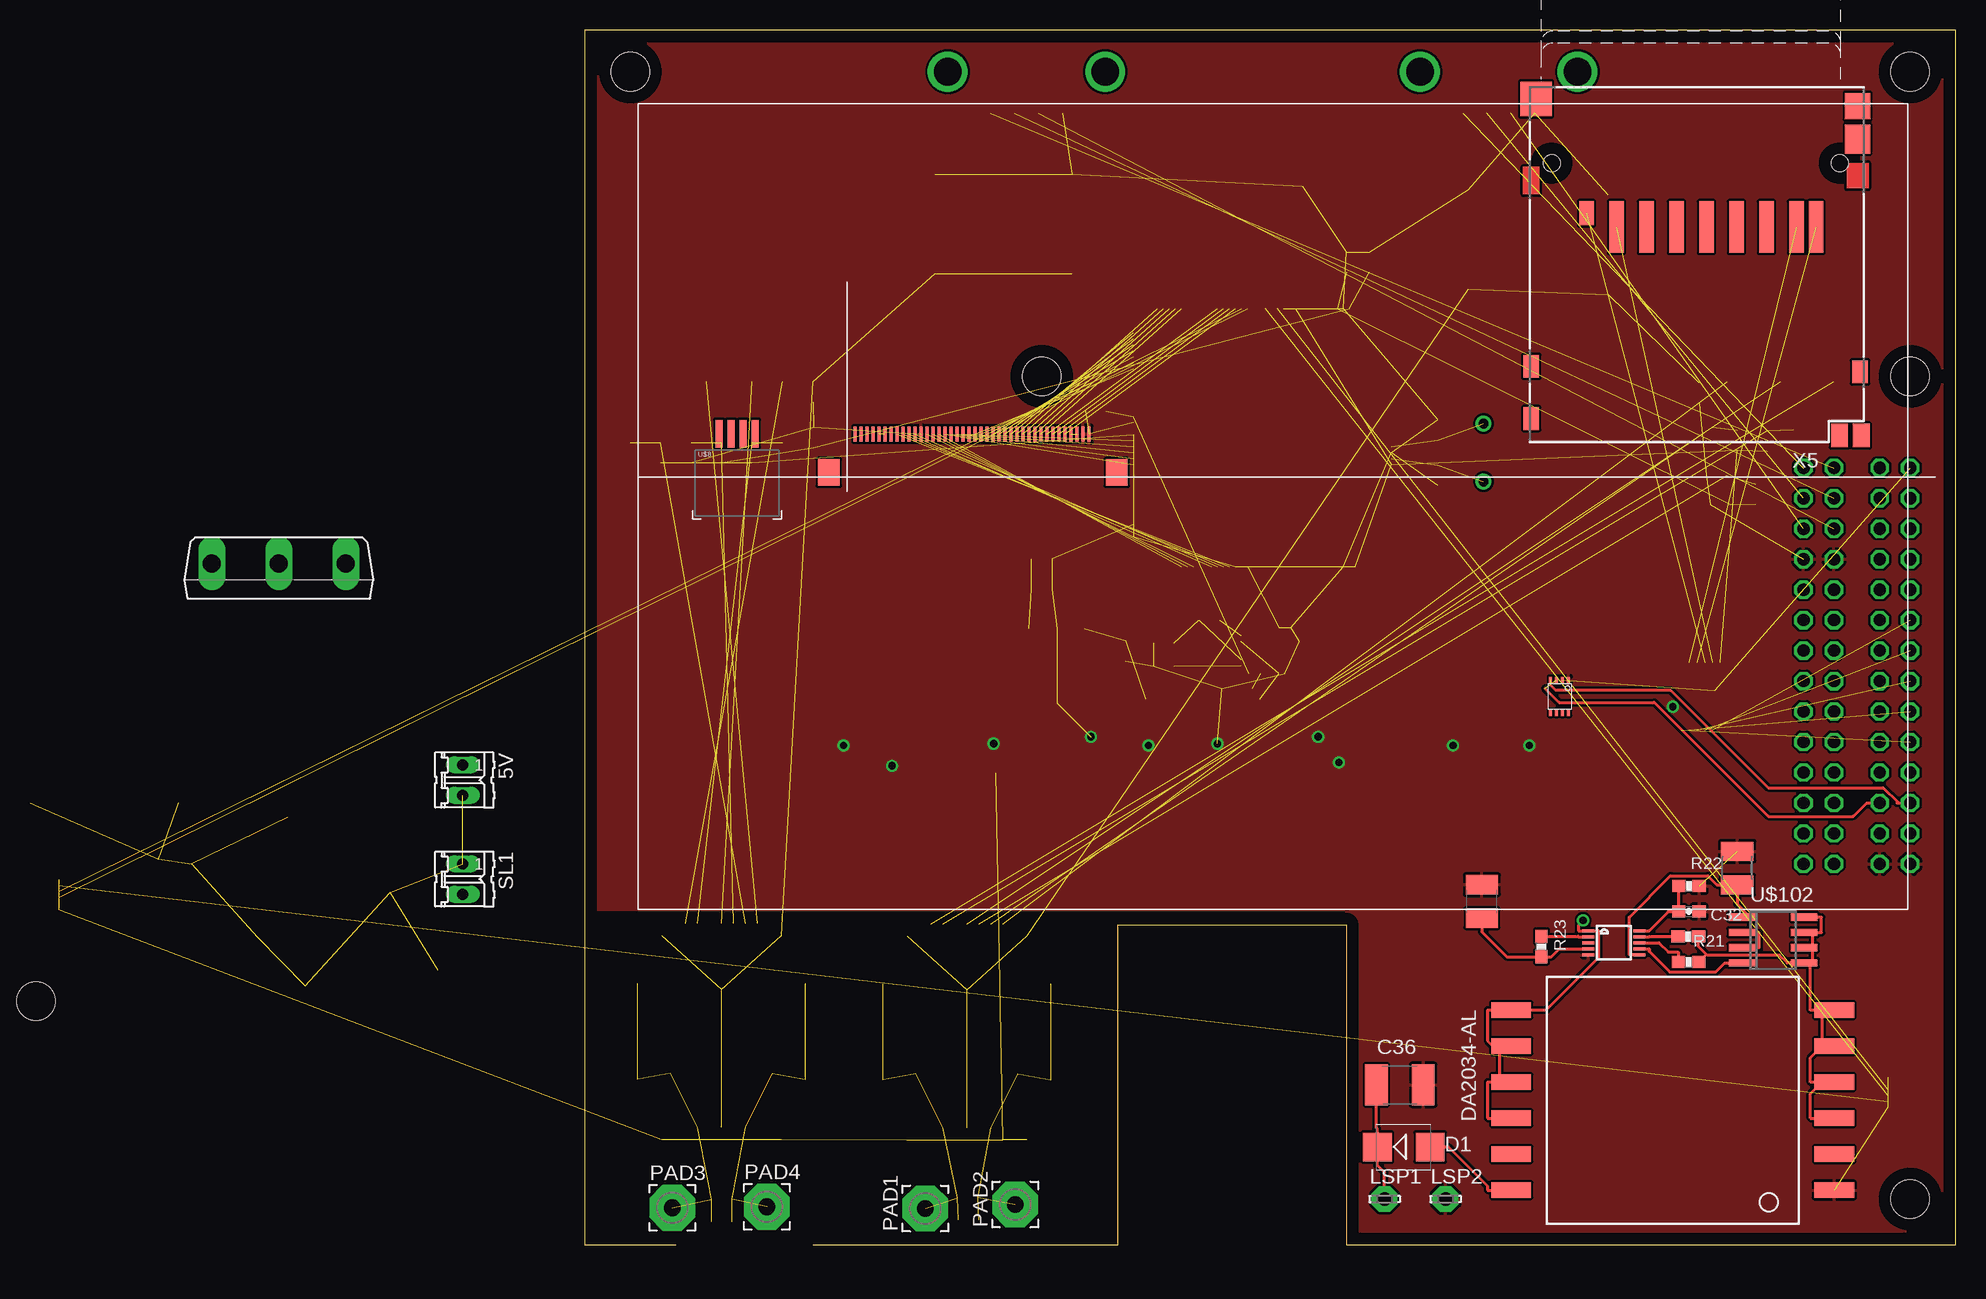
[diagram p6: board, top side]
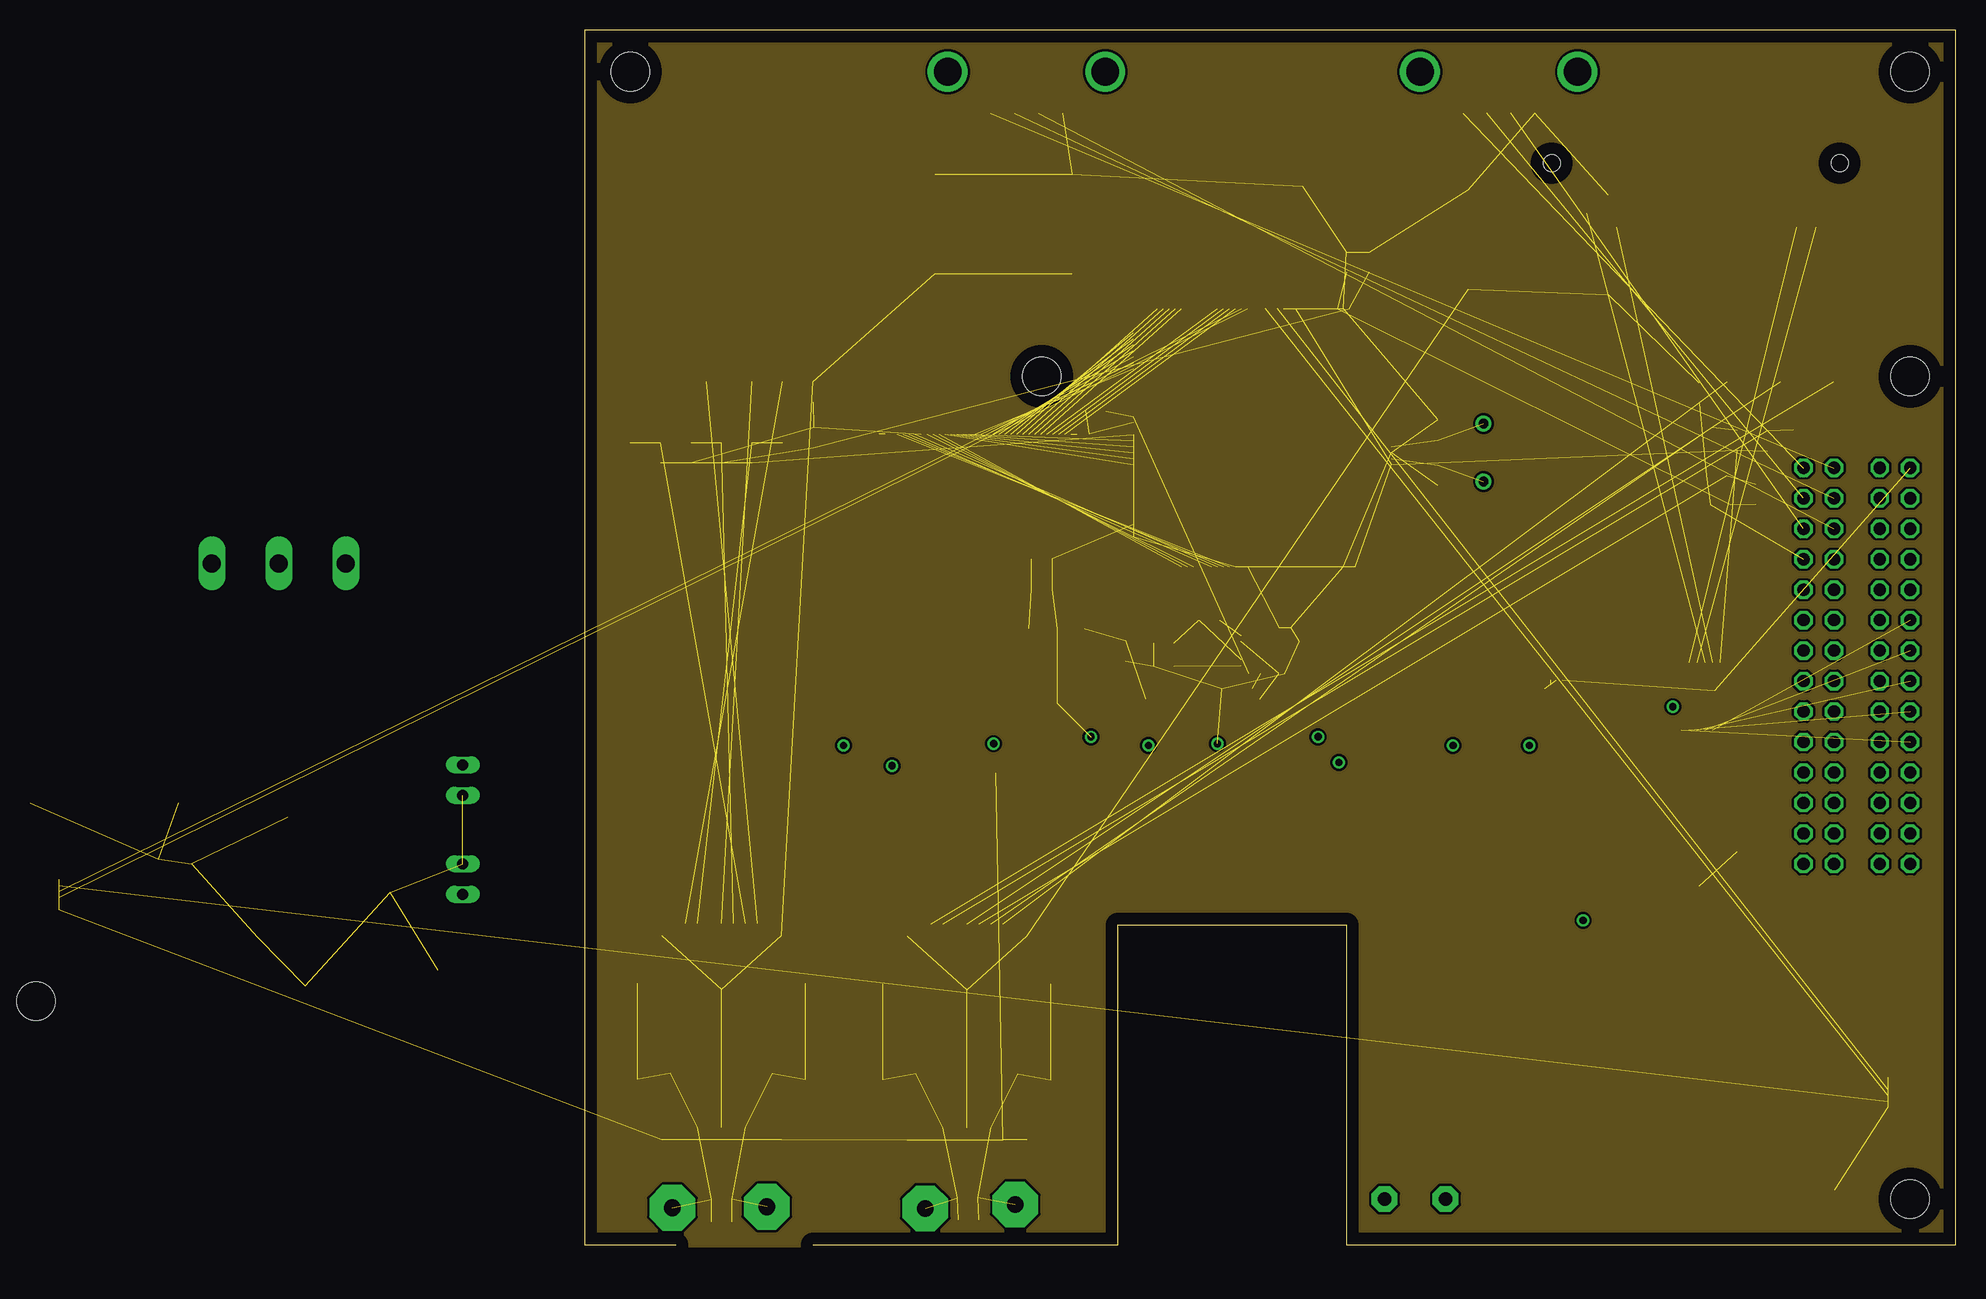
[diagram p7: board, inner layer Route2]
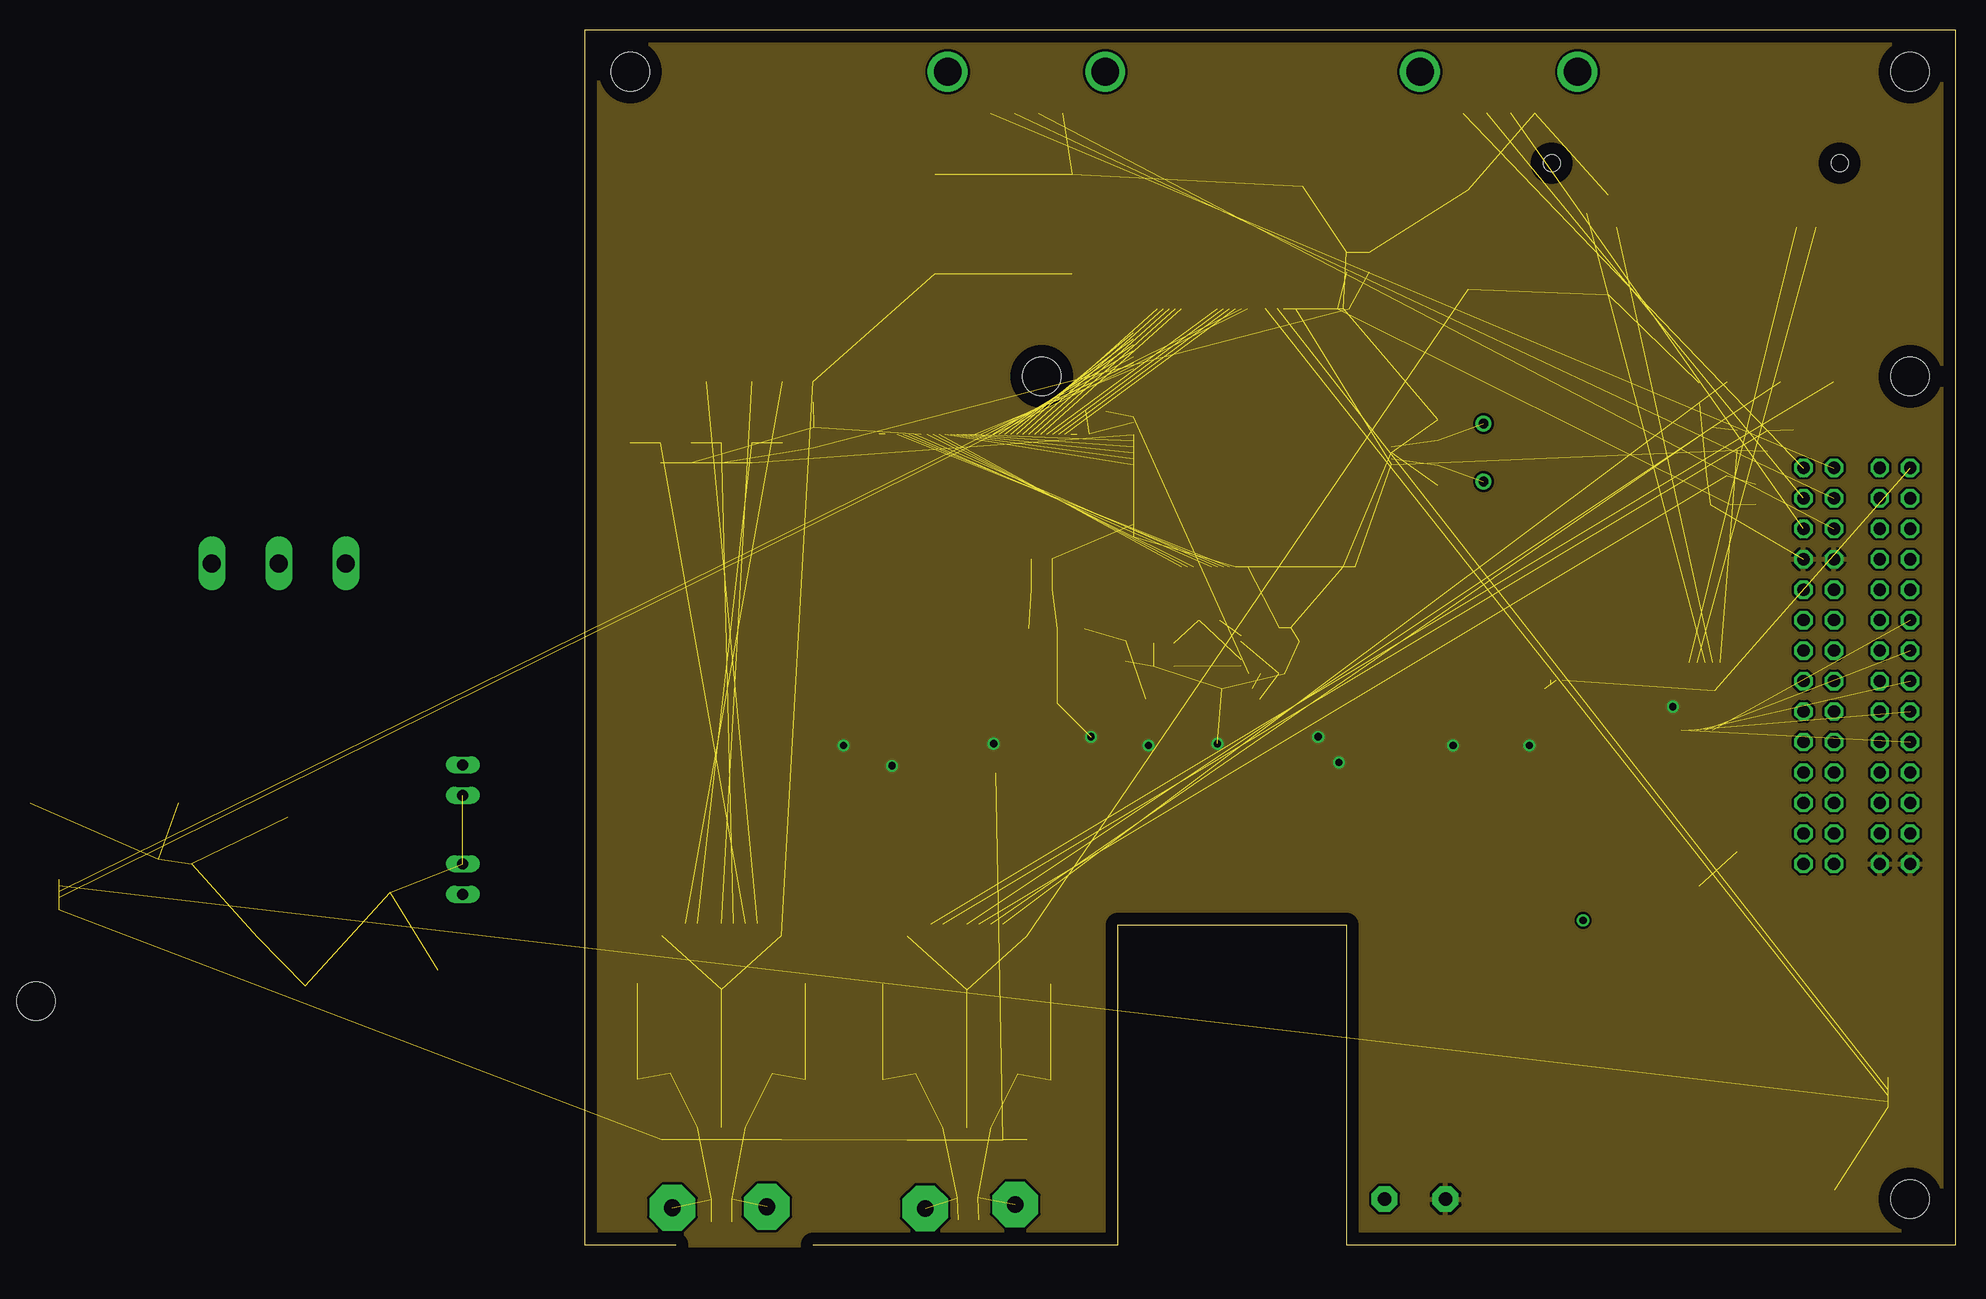
[diagram p8: board, inner layer Route15]
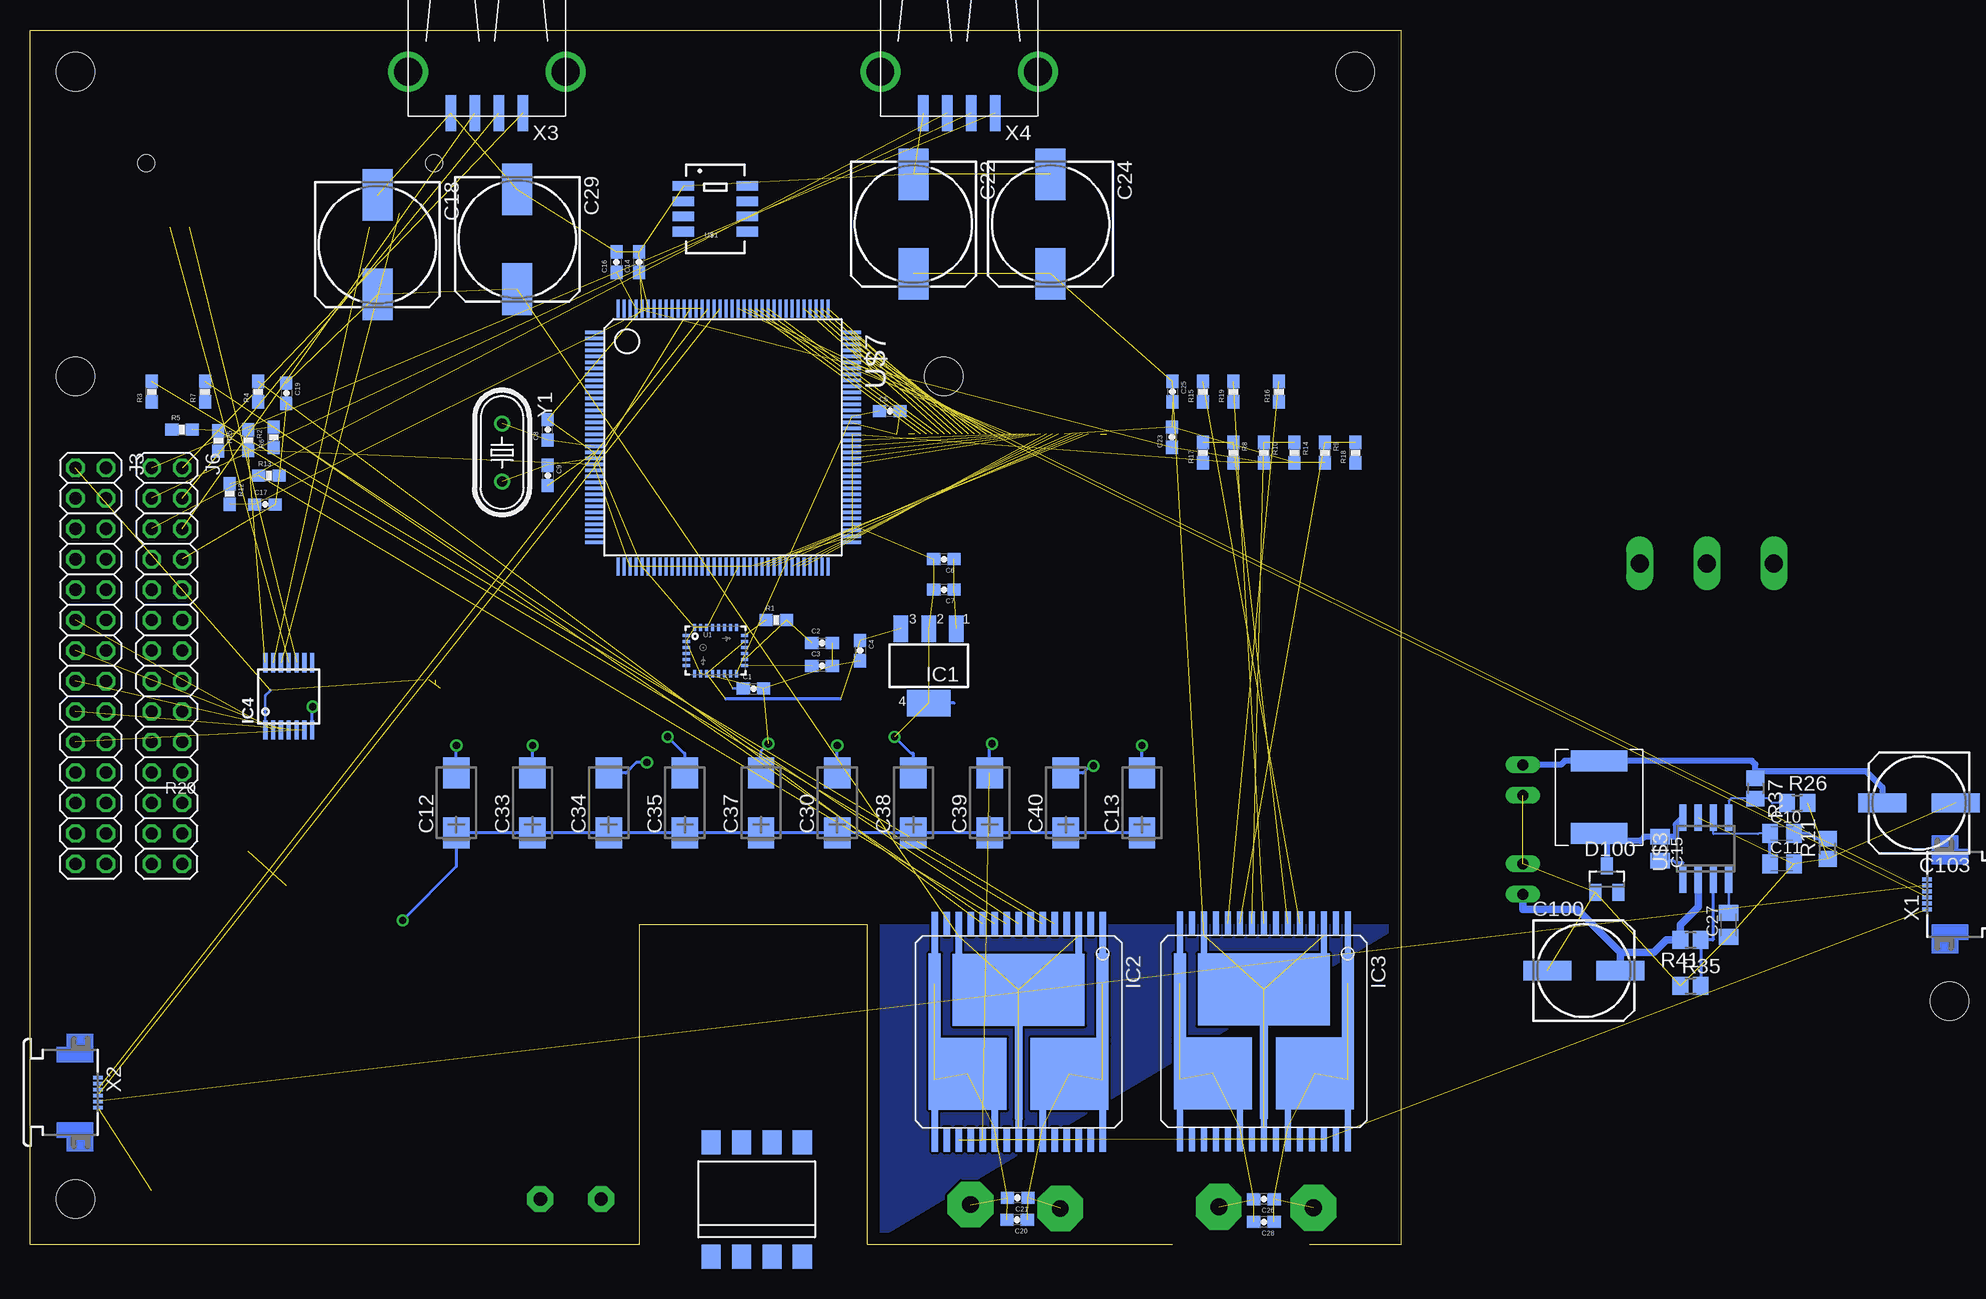
[diagram p9: board, bottom side, seen from below]

Size 114.28 x 101.27 mm. Coordinates in mm from the lower left corner, seen from the top.
Outline: 7.62,0 0,0 0,101.27 114.28,101.27 114.28,0 63.5,0 63.5,26.67 44.45,26.67 44.45,0 19.05,0
Copper layers (1*2+15*16): Top 0.035mm / dielectric 0.2mm / Route2 0.035mm / dielectric 1.2mm / Route15 0.035mm / dielectric 0.2mm / Bottom 0.035mm
Design rules "default *": minimum track width 10mil, minimum drill 24mil, track to track 8mil, track to pad 8mil, pad to pad 8mil, via to via 8mil, smd to smd 8mil, copper to edge 40mil, drill to drill 8mil, minimum pad ring 10mil, minimum via ring 8mil, stop-mask expansion 4mil, vias tented up to drill 0mil, thermal gap 10mil
Holes 3.2 mm at -45.72,20.32 110.49,3.81 110.49,97.79 3.81,97.79 110.49,72.39 38.1,72.39

### Footprints (pad centres in the part's own frame; a part is rotated, then mirrored left to right if it is on the bottom)
02P = drill 0.914 long: 1 -1.27,0; 2 1.27,0
0603-CAP = smd 1.1 x 1: 1 -0.85,0; 2 0.85,0
C0805K = smd 1.3 x 1.6: 1 -1,0; 2 1,0
CT6032 = smd 2.6 x 2.2: + -2.5,0; - 2.5,0
153CLV-1014 = smd 4.3 x 2.5: + 4.15,0; - -4.15,0
C1210 = smd 1.6 x 2.7: 1 -1.4,0; 2 1.4,0
C1812 = smd 1.9 x 3.4: 1 -1.95,0; 2 1.95,0
153CLV-0807 = smd 4 x 1.6: + 3.05,0; - -3.05,0
SMB = smd 2.4 x 2.4: A 2.2,0; C -2.2,0
SOT23 = smd 1 x 1.4: 1 -0.95,-1.1; 2 0.95,-1.1; 3 0,1.1
SOT223 = smd 1.219 x 2.235: 1 -2.311,-3.099; 2 0,-3.099; 3 2.311,-3.099 | smd 3.6 x 2.2: 4 0,3.099
MULTIPOWERSO-30 = smd 0.508 x 12: 1 -7,-4; 15 7,-4; 16 7,4; 30 -7,4 | smd 0.508 x 2: 2 -6,-9; 4 -4,-9; 5 -3,-9; 6 -2,-9; 7 -1,-9; 8 0,-9; 9 1,-9; 10 2,-9; 11 3,-9; 12 4,-9; 14 6,-9; 17 6,9; 18 5,9; 19 4,9; 20 3,9; 22 1,9; 24 -1,9; 26 -3,9; 27 -4,9; 28 -5,9; 29 -6,9 | smd 0.508 x 4: 3 -5,-8; 13 5,-8; 21 2,8; 23 0,8; 25 -2,8 | smd 6.5 x 6: OUTA -4.25,3.5; OUTB 4.25,3.5 | smd 1 x 7.5: OUTA@1 -7,-2.755; OUTB@1 7,-2.755 | smd 11 x 6: VCC 0,-3.5 | smd 0.65 x 8.3: VCC@1 0,3.145
TSSOP14 = smd 0.35 x 1.6: 1 -1.95,-2.8; 2 -1.3,-2.8; 3 -0.65,-2.8; 4 0,-2.8; 5 0.65,-2.8; 6 1.3,-2.8; 7 1.95,-2.8; 8 1.95,2.8; 9 1.3,2.8; 10 0.65,2.8; 11 0,2.8; 12 -0.65,2.8; 13 -1.3,2.8; 14 -1.95,2.8
2X14 = drill 1.016 octagon: 1 -16.51,-1.27; 2 -16.51,1.27; 3 -13.97,-1.27; 4 -13.97,1.27; 5 -11.43,-1.27; 6 -11.43,1.27; 7 -8.89,-1.27; 8 -8.89,1.27; 9 -6.35,-1.27; 10 -6.35,1.27; 11 -3.81,-1.27; 12 -3.81,1.27; 13 -1.27,-1.27; 14 -1.27,1.27; 15 1.27,-1.27; 16 1.27,1.27; 17 3.81,-1.27; 18 3.81,1.27; 19 6.35,-1.27; 20 6.35,1.27; 21 8.89,-1.27; 22 8.89,1.27; 23 11.43,-1.27; 24 11.43,1.27; 25 13.97,-1.27; 26 13.97,1.27; 27 16.51,-1.27; 28 16.51,1.27
LSP11 = drill 1.118 pad 2.159 octagon: MP 0,0
MSOP = smd 0.25 x 1: 1 -1,-2.113; 2 -0.5,-2.113; 3 0,-2.113; 4 0.5,-2.113; 5 1,-2.113; 6 1,2.113; 7 0.5,2.113; 8 0,2.113; 9 -0.5,2.113; 10 -1,2.113
3,81/1,4 = drill 1.397 pad 3.81 octagon: 1 0,0
TO247BV = drill 1.499 long: D 0,-2.921; G -5.588,-2.921; S 5.588,-2.921
0603-RES = smd 1.1 x 1: 1 -0.85,0; 2 0.85,0
R0805 = smd 1.3 x 1.5: 1 -0.85,0; 2 0.85,0
R1210 = smd 1.6 x 2.7: 1 -1.4,0; 2 1.4,0
DA2034-AL = smd 3.3 x 1.27: P$1 -13.46,7.5; P$2 -13.46,4.5; P$3 -13.46,1.5; P$4 -13.46,-1.5; P$5 -13.46,-4.5; P$6 -13.46,-7.5; P$7 13.46,-7.5; P$8 13.46,-4.5; P$9 13.46,-1.5; P$10 13.46,1.5; P$11 13.46,4.5; P$12 13.46,7.5
QFN-28_6X8 = smd 0.6 x 0.25: 1 -2.417,1.25; 2 -2.417,0.75; 3 -2.417,0.25; 4 -2.417,-0.25; 5 -2.417,-0.75; 6 -2.417,-1.25; 15 2.433,-1.25; 16 2.433,-0.75; 17 2.433,-0.25; 18 2.433,0.25; 19 2.433,0.75; 20 2.433,1.25 | smd 0.25 x 0.6: 7 -1.742,-1.925; 8 -1.242,-1.925; 9 -0.742,-1.925; 10 -0.242,-1.925; 11 0.258,-1.925; 12 0.758,-1.925; 13 1.258,-1.925; 14 1.758,-1.925; 21 1.758,1.925; 22 1.258,1.925; 23 0.758,1.925; 24 0.258,1.925; 25 -0.242,1.925; 26 -0.742,1.925; 27 -1.242,1.925; 28 -1.742,1.925
SHT1X = smd 1.8 x 0.8: 1 -2.667,1.905; 2 -2.667,0.635; 3 -2.667,-0.635; 4 -2.667,-1.905; 5 2.667,-1.905; 6 2.667,-0.635; 7 2.667,0.635; 8 2.667,1.905
SO8 = smd 0.6 x 2.2: 1 -1.905,-2.6; 2 -0.635,-2.6; 3 0.635,-2.6; 4 1.905,-2.6; 5 1.905,2.6; 6 0.635,2.6; 7 -0.635,2.6; 8 -1.905,2.6
PSOP-8 = smd 0.25 x 0.5: 1 -0.73,-1.37; 2 -0.23,-1.37; 3 0.27,-1.37; 4 0.77,-1.37; 5 0.77,1.38; 6 0.27,1.38; 7 -0.23,1.38; 8 -0.73,1.38
TQFP144 = smd 0.27 x 1.5: 1 -8.75,-10.75; 2 -8.25,-10.75; 3 -7.75,-10.75; 4 -7.25,-10.75; 5 -6.75,-10.75; 6 -6.25,-10.75; 7 -5.75,-10.75; 8 -5.25,-10.75; 9 -4.75,-10.75; 10 -4.25,-10.75; 11 -3.75,-10.75; 12 -3.25,-10.75; 13 -2.75,-10.75; 14 -2.25,-10.75; 15 -1.75,-10.75; 16 -1.25,-10.75; 17 -0.75,-10.75; 18 -0.25,-10.75; 19 0.25,-10.75; 20 0.75,-10.75; 21 1.25,-10.75; 22 1.75,-10.75; 23 2.25,-10.75; 24 2.75,-10.75; 25 3.25,-10.75; 26 3.75,-10.75; 27 4.25,-10.75; 28 4.75,-10.75; 29 5.25,-10.75; 30 5.75,-10.75; 31 6.25,-10.75; 32 6.75,-10.75; 33 7.25,-10.75; 34 7.75,-10.75; 35 8.25,-10.75; 36 8.75,-10.75; 73 8.75,10.75; 74 8.25,10.75; 75 7.75,10.75; 76 7.25,10.75; 77 6.75,10.75; 78 6.25,10.75; 79 5.75,10.75; 80 5.25,10.75; 81 4.75,10.75; 82 4.25,10.75; 83 3.75,10.75; 84 3.25,10.75; 85 2.75,10.75; 86 2.25,10.75; 87 1.75,10.75; 88 1.25,10.75; 89 0.75,10.75; 90 0.25,10.75; 91 -0.25,10.75; 92 -0.75,10.75; 93 -1.25,10.75; 94 -1.75,10.75; 95 -2.25,10.75; 96 -2.75,10.75; 97 -3.25,10.75; 98 -3.75,10.75; 99 -4.25,10.75; 100 -4.75,10.75; 101 -5.25,10.75; 102 -5.75,10.75; 103 -6.25,10.75; 104 -6.75,10.75; 105 -7.25,10.75; 106 -7.75,10.75; 107 -8.25,10.75; 108 -8.75,10.75 | smd 1.5 x 0.27: 37 10.75,-8.75; 38 10.75,-8.25; 39 10.75,-7.75; 40 10.75,-7.25; 41 10.75,-6.75; 42 10.75,-6.25; 43 10.75,-5.75; 44 10.75,-5.25; 45 10.75,-4.75; 46 10.75,-4.25; 47 10.75,-3.75; 48 10.75,-3.25; 49 10.75,-2.75; 50 10.75,-2.25; 51 10.75,-1.75; 52 10.75,-1.25; 53 10.75,-0.75; 54 10.75,-0.25; 55 10.75,0.25; 56 10.75,0.75; 57 10.75,1.25; 58 10.75,1.75; 59 10.75,2.25; 60 10.75,2.75; 61 10.75,3.25; 62 10.75,3.75; 63 10.75,4.25; 64 10.75,4.75; 65 10.75,5.25; 66 10.75,5.75; 67 10.75,6.25; 68 10.75,6.75; 69 10.75,7.25; 70 10.75,7.75; 71 10.75,8.25; 72 10.75,8.75; 109 -10.75,8.75; 110 -10.75,8.25; 111 -10.75,7.75; 112 -10.75,7.25; 113 -10.75,6.75; 114 -10.75,6.25; 115 -10.75,5.75; 116 -10.75,5.25; 117 -10.75,4.75; 118 -10.75,4.25; 119 -10.75,3.75; 120 -10.75,3.25; 121 -10.75,2.75; 122 -10.75,2.25; 123 -10.75,1.75; 124 -10.75,1.25; 125 -10.75,0.75; 126 -10.75,0.25; 127 -10.75,-0.25; 128 -10.75,-0.75; 129 -10.75,-1.25; 130 -10.75,-1.75; 131 -10.75,-2.25; 132 -10.75,-2.75; 133 -10.75,-3.25; 134 -10.75,-3.75; 135 -10.75,-4.25; 136 -10.75,-4.75; 137 -10.75,-5.25; 138 -10.75,-5.75; 139 -10.75,-6.25; 140 -10.75,-6.75; 141 -10.75,-7.25; 142 -10.75,-7.75; 143 -10.75,-8.25; 144 -10.75,-8.75
PSP_TOUCH_CONNECTOR = smd 0.6 x 2.3: X1 1.5,2.85; X2 -0.5,2.85; Y1 -1.5,2.85; Y2 0.5,2.85
PSP_CONNECTOR = smd 0.001 x 0.001 bottom: . 4.4,25.3 | smd 1.27 x 0.254: AVDD 1,6; AVDD2 1,5.5; B0 1,13; B1 1,12.5; B2 1,12; B3 1,11.5; B4 1,11; B5 1,10.5; B6 1,10; B7 1,9.5; CK 1,8.5; DISP 1,8; G0 1,17; G1 1,16.5; G2 1,16; G3 1,15.5; G4 1,15; G5 1,14.5; G6 1,14; G7 1,13.5; GND 1,23; GND2 1,22.5; GND3 1,9; HSYNC 1,7.5; NC 1,6.5; NC2 1,5; R0 1,21; R1 1,20.5; R2 1,20; R3 1,19.5; R4 1,19; R5 1,18.5; R6 1,18; R7 1,17.5; TEST1 1,4.5; TEST2 1,4; TEST3 1,3.5; VCC 1,22; VCC2 1,21.5; VSYNC 1,7 | smd 2.2 x 1.8: GND4 4.2,25.3; GND5 4.2,1.3
DIL8-SMD = smd 1.6 x 2: 1 -3.81,-4.77; 2 -1.27,-4.77; 3 1.27,-4.77; 4 3.81,-4.77; 5 3.81,4.77; 6 1.27,4.77; 7 -1.27,4.77; 8 -3.81,4.77
CR75 = smd 1.75 x 4.7: P$1 0,0; P$2 6.05,0
52746-6 = smd 0.3 x 0.8: 1 -1.25,0.6; 2 -0.75,0.6; 3 -0.25,0.6; 4 0.25,0.6; 5 0.75,0.6; 6 1.25,0.6
USB-A-S = smd 3 x 0.9: D+ 3.45,-1; D- 3.45,1; GND 3.45,-3; VBUS 3.45,3 | drill 2.311 round: P$5 0,-6.566; P$6 0,6.566
SDBMF-009XXBXX2 = smd 1.2 x 4.3: 1 6.7,5.325; 2 4.2,5.325; 3 1.7,5.325; 4 -0.8,5.325; 5 -3.3,5.325; 6 -5.8,5.325; 7 -8.3,5.325; 8 -9.925,5.325 | smd 1.2 x 2: 9 9.2,4.175 | smd 2.1 x 2.4: M1 -13.4,-2 | smd 2.6 x 2.9: M2 13.4,-5.35 | smd 1.3 x 1.9: M3 -13.6,17.4; M4 13.8,16.95; M5 13.8,21.3 | smd 1.4 x 1.95: SW1 -11.9,22.7; SW3 -13.7,22.7 | smd 2.1 x 2.2: SW2 -13.4,-4.75 | hole 1.4: -11.9,0; 12.1,0
HC49U-V = drill 0.813 round: 1 -2.413,0; 2 2.413,0

### Placement (x,y rotation side)
5V  -10.16,38.73 270 top  (outside the outline)
C1  53.98,46.35 0 bottom
C2  48.26,50.16 0 bottom
C3  48.26,48.26 0 bottom
C4  45.09,49.53 270 bottom
C5  42.61,69.5 0 bottom
C6  38.1,57.15 180 bottom
C7  38.1,54.61 180 bottom
C8  71.12,67.94 90 bottom
C9  71.12,64.14 270 bottom
C10  -31.75,34.29 0 bottom  (outside the outline)
C11  -31.75,31.75 0 bottom  (outside the outline)
C12  78.74,36.83 90 bottom
C13  21.59,36.83 90 bottom
C14  63.5,81.92 90 bottom
C15  -21.59,33.02 270 bottom  (outside the outline)
C16  65.41,81.92 90 bottom
C17  94.69,61.72 0 bottom
C18  85.32,83.36 270 bottom
C19  92.91,70.99 270 bottom
C20  32,2.08 180 bottom
C21  31.95,3.91 180 bottom
C22  40.64,85.09 270 bottom
C23  19.1,67.32 90 bottom
C24  29.21,85.09 270 bottom
C25  19.05,71.12 270 bottom
C26  11.43,3.81 180 bottom
C27  -27.3,26.67 90 bottom  (outside the outline)
C28  11.43,1.91 180 bottom
C29  73.66,83.82 270 bottom
C30  46.99,36.83 90 bottom
C31  74.79,28.62 90 top
C32  92.05,27.79 0 top
C33  72.39,36.83 90 bottom
C34  66.04,36.83 90 bottom
C35  59.69,36.83 90 bottom
C36  67.94,13.34 0 top
C37  53.34,36.83 90 bottom
C38  40.64,36.83 90 bottom
C39  34.29,36.83 90 bottom
C40  27.94,36.83 90 bottom
C100  -15.24,22.86 0 bottom  (outside the outline)
C103  -43.18,36.83 180 bottom  (outside the outline)
D1  68.28,8.15 0 top
D100  -17.14,30.48 0 bottom  (outside the outline)
IC1  39.37,48.26 180 bottom
IC2  31.86,17.77 180 bottom
IC3  11.43,17.78 180 bottom
IC4  92.71,45.72 0 bottom
J3  109.22,48.26 270 bottom
J6  102.87,48.26 270 bottom
LSP1  66.67,3.81 0 top
LSP2  71.75,3.81 0 top
LT  85.79,25.18 270 top
PAD1  28.4,3.02 90 top
PAD2  35.89,3.35 90 top
PAD3  7.3,3.09 0 top
PAD4  15.19,3.16 0 top
Q2  -25.49,53.89 180 top  (outside the outline)
R1  52.07,52.07 0 bottom
R2  96.09,67.08 270 bottom
R3  104.14,71.12 90 bottom
R4  95.25,71.12 90 bottom
R5  101.6,67.94 0 bottom
R6  93.98,67.31 90 bottom
R7  99.69,71.12 90 bottom
R8  13.97,66.04 270 bottom
R9  6.35,66.04 270 bottom
R10  11.43,66.04 270 bottom
R11  -35.56,33.02 90 bottom  (outside the outline)
R12  97.64,62.59 270 bottom
R13  94.36,64.11 0 bottom
R14  8.89,66.04 270 bottom
R15  16.51,71.12 90 bottom
R16  10.16,71.12 90 bottom
R17  16.51,66.04 90 bottom
R18  3.81,66.04 90 bottom
R19  13.97,71.12 90 bottom
R20  96.07,31.4 90 top
R21  92.01,23.58 0 top
R22  92.05,29.91 0 top
R23  79.76,24.86 90 top
R24  92,25.69 0 top
R25  98.58,67.01 270 bottom
R26  -33.02,36.83 0 bottom  (outside the outline)
R35  -24.13,21.59 0 bottom  (outside the outline)
R37  -29.55,38.04 270 bottom  (outside the outline)
R41  -24.13,25.4 180 bottom  (outside the outline)
SL1  -10.16,30.48 270 top  (outside the outline)
TRAFO  90.7,12.05 180 top
U1  57.15,49.53 0 bottom
U$1  57.15,86.36 0 bottom
U$3  -25.4,33.02 0 bottom  (outside the outline)
U$4  81.28,45.72 180 top
U$5  [PSP-SCREEN]  4.45,27.94 0 top
U$7  56.52,67.31 270 bottom
U$8  12.7,64.77 0 top
U$9  19.05,68.58 270 top
U$10  53.71,3.79 0 bottom
U$100  -16.51,34.29 90 bottom  (outside the outline)
U$102  99.06,25.4 270 top
X1  -44.45,29.21 90 bottom  (outside the outline)
X2  109.22,12.7 270 bottom
X3  76.2,97.79 270 bottom
X4  36.83,97.79 270 bottom
X5  92.71,90.17 180 top
Y1  74.93,66.04 270 bottom

### Tracks (layer width: path | path; a pad name or v marks a point on that pad's centre or on a via)
2V5_TFT  (1 unrouted)
3V0  (4 unrouted)
  Bottom 0.254: 46.74,45.49 56.29,45.49
3V3  (10 unrouted)
  pour Route2: 0,0 44.45,0 44.45,26.67 63.5,26.67 63.5,0 114.3,0 114.3,101.6 0,101.6
5V  (1 unrouted)
5V_TFT  (1 unrouted)
+5V_PANDA
  Bottom 0.508: C103.+ -40.13,38.14 -38.8,39.47 -29.55,39.47 | -29.55,39.47 -29.55,40.05 -29.26,40.34 U$100.P$2 -13.65,40.34 -13.32,40.01 5V.1 | -29.55,39.47 R37.1 | -29.55,39.47
AN0  (3 unrouted)
AN1  (3 unrouted)
BCLK  (1 unrouted)
BLUE0  (1 unrouted)
BLUE1  (1 unrouted)
BLUE2  (1 unrouted)
BLUE3  (1 unrouted)
BLUE4  (1 unrouted)
BLUE5  (1 unrouted)
BLUE6  (1 unrouted)
BLUE7  (1 unrouted)
CLK6  (1 unrouted)
CLK7  (1 unrouted)
CPOUT  (1 unrouted)
  Bottom 0.203: C1.1 55.68,46.35
CS6  (1 unrouted)
CS7  (1 unrouted)
DISP  (1 unrouted)
ENABLE_5VSTBY
  Bottom 0.254: U$3.3 -26.04,25.48 -25.96,25.4 R41.1 R35.2
GND  (via drill 0.6 pad 1.01)  (55 unrouted)
  Bottom 0.254: C34.- 64.61,39.33 63.74,40.2 v62.87,40.2 | C35.- 59.69,40.96 59.76,40.96 v61.14,42.35 | v90.71,44.85 90.76,44.81 IC4.7 | C38.- 40.64,40.96 40.82,40.96 v42.21,42.35 | 37.24,45.16 IC1.4 | v25.63,39.93 25.91,39.93 26.51,39.33 C40.- | C39.- 34.29,41.58 v34.1,41.77 | C37.- 53.34,41.17 v52.74,41.77 | C33.- v72.39,41.63 | C30.- v46.99,41.63 | C13.- v21.59,41.63 | C12.- v78.74,41.63
  pour Route15: 44.45,0 44.45,26.67 63.5,26.67 63.5,0 114.3,0 114.3,101.6 0,101.6 0,0
  pour Top: 63.5,0 114.3,0 114.3,101.6 0,101.6 0,27.94 63.5,27.94
GREEN0  (1 unrouted)
GREEN1  (1 unrouted)
GREEN2  (1 unrouted)
GREEN3  (1 unrouted)
GREEN4  (1 unrouted)
GREEN5  (1 unrouted)
GREEN6  (1 unrouted)
GREEN7  (1 unrouted)
GYRO_Z  (2 unrouted)
HSYNC  (1 unrouted)
I2C4_SCL  (1 unrouted)
  Top 0.254: 80.05,46.39 81.22,45.22 89.17,45.22 98.67,35.72 105.75,35.72 106.86,36.83 J3.24
I2C4_SDA  (1 unrouted)
  Top 0.254: 80.51,46.66 80.93,46.24 90.5,46.24 98.65,38.1 108.24,38.1 109.4,36.94 109.4,36.83 J3.23
MOTOR1CS  (2 unrouted)
MOTOR1DIAGA  (2 unrouted)
MOTOR1DIAGB  (2 unrouted)
MOTOR1INA  (1 unrouted)
MOTOR1INB  (1 unrouted)
MOTOR1L  (7 unrouted)
MOTOR1POWER  (7 unrouted)
MOTOR1PWM  (1 unrouted)
MOTOR1R  (7 unrouted)
MOTOR2CS  (2 unrouted)
MOTOR2DIAGA  (2 unrouted)
MOTOR2DIAGB  (2 unrouted)
MOTOR2INA  (1 unrouted)
MOTOR2INB  (1 unrouted)
MOTOR2L  (7 unrouted)
MOTOR2POWER  (7 unrouted)
MOTOR2PWM  (1 unrouted)
MOTOR2R  (7 unrouted)
N$5  (2 unrouted)
N$6
  Bottom 0.152: U$3.6 -26.04,34.24 -29.77,34.24 -29.82,34.29 C10.1
  Bottom 0.254: C11.1 C10.1
N$12  (1 unrouted)
N$13  (1 unrouted)
N$14  (1 unrouted)
N$15  (1 unrouted)
N$18
  Bottom 0.254: R11.2 -34.48,33.87 -34.06,34.29 C10.2
N$20
  Bottom 0.203: C27.2 U$3.4
N$30
  Bottom 0.254: C15.2 -22.72,32.02 -22.89,31.85 -23.5,31.85 U$3.1
N$32
  Bottom 0.152: U$3.5 -27.3,37 -27.5,37.19 -28.52,37.19 R37.2 -30.58,37.19 -30.94,36.83 R26.1
N$33
  Bottom 0.508: U$3.8 -22.9,35.02 -22.9,34.02 C15.1 -20.28,34.02 -19.92,33.66 -17.14,33.66 | -17.14,33.66 D100.3 | -17.14,33.66 U$100.P$1
N$45  (2 unrouted)
N$63  (2 unrouted)
N$64  (1 unrouted)
N$65  (1 unrouted)
N$69  (2 unrouted)
N$71
  Top 0.254: TRAFO.P$12 75.26,4.55 75.26,4.9 72.01,8.15 D1.A
N$72
  Top 0.254: LT.7 88.73,24.68 88.73,24.45 90.44,22.75 94.28,22.75 95.03,23.5 U$102.4
N$73
  Top 0.254: LT.9 88.73,25.68 88.75,25.69 R24.1
N$74
  Top 0.254: R21.1 91.16,24.41 90.33,24.41 89.56,25.18 LT.8
N$75
  Top 0.254: 103.17,19.55 102.18,19.55 102.18,23.3 102.38,23.5 | 103.17,19.55 TRAFO.P$6 | 103.17,16.55 103.17,19.55 | 102.38,23.5 102.38,24.77 | TRAFO.P$3 102.18,10.55 102.18,12.56 103.17,13.55 | 103.17,13.55 102.18,13.55 102.18,15.56 103.17,16.55 | 103.17,13.55 TRAFO.P$4 | 103.17,16.55 TRAFO.P$5 | 102.38,26.04 103.09,26.04 103.09,27.3 U$102.8 | 102.38,26.04 U$102.7 | 102.38,24.77 102.38,26.04 | 102.38,24.77 U$102.6 | 102.38,23.5 U$102.5 100.23,23.5 99.6,24.12 93.58,24.12 93.5,24.21 | 93.5,24.21 92.85,24.86 R24.2 | 93.5,24.21 R21.2
N$76
  Top 0.254: 97.17,26.04 97.89,26.04 97.89,24.77 U$102.3 | 97.17,26.04 U$102.2 | 97.17,27.3 97.17,26.04 | 97.17,27.3 96.07,28.41 R20.1 94.39,30 93.64,30.75 90.51,30.75 87.07,27.31 87.07,24.18 LT.6 | 97.17,27.3 U$102.1
N$77
  Top 0.254: C31.1 74.79,26.09 76.87,24.01 R23.1 80.59,24.01 81.26,24.68 LT.4
N$78
  Top 0.254: LT.10 88.73,26.18 90.32,27.77 90.32,27.79 C32.1 R22.1
N$79
  Top 0.254: LT.2 82.84,25.68 82.81,25.71 R23.2
N$80
  Top 0.254: C36.1 66,9.77 66.08,9.68 D1.C 66.08,6.62 66.67,6.03 LSP1.MP
PGND  (10 unrouted)
  pour Bottom: 0,26.67 44.45,0 44.45,26.67
RED0  (1 unrouted)
RED1  (1 unrouted)
RED2  (1 unrouted)
RED3  (1 unrouted)
RED4  (1 unrouted)
RED5  (1 unrouted)
RED6  (1 unrouted)
RED7  (1 unrouted)
SDMMC2_CMD  (1 unrouted)
SDMMC2_DAT0  (1 unrouted)
SDMMC2_DAT1  (1 unrouted)
SDMMC2_DAT2  (1 unrouted)
SDMMC2_DAT3  (1 unrouted)
USBH3_DM  (1 unrouted)
USBH3_DP  (1 unrouted)
USBH4_DM  (1 unrouted)
USBH4_DP  (1 unrouted)
VBAT
  Bottom 0.635: SL1.2 -10.16,27.98 -14.69,27.98 -18.29,24.38 | -18.29,24.38 -21.09,24.38 -22.11,25.4 R41.2 -23.28,26.67 -24.77,28.16 U$3.2 | -18.29,24.38 -18.29,24.18 C100.+
VBUS_3  (1 unrouted)
VBUS_4  (1 unrouted)
VIO_1V8  (2 unrouted)
  Bottom 0.203: IC4.1 94.66,45.77
  Bottom 0.254: 94.66,45.77 94.23,46.21
VSYNC  (1 unrouted)
VTRANS  (via drill 0.6 pad 1.01)
  Top 0.254: 76.25,16.55 75.71,16.55 75.26,17 75.26,19.55 TRAFO.P$7 80.14,19.55 84.5,23.91 84.5,26.18 LT.1 82.84,26.18 82.84,26.66 v83.23,27.04 | 76.25,16.55 TRAFO.P$8 | 76.25,13.55 75.26,13.55 75.26,10.55 TRAFO.P$10 | 76.25,13.55 TRAFO.P$9 | 76.25,16.55 76.25,13.55
  Bottom 0.254: v83.23,27.04 78.74,31.53 C12.+ 73.82,34.33 C33.+ C34.+ C35.+ C37.+ C30.+ C38.+ C39.+ C40.+ C13.+